# EAGLE design APU (EAGLE 9.6.2)

## Sheet 1 of 3: APU_Capteur
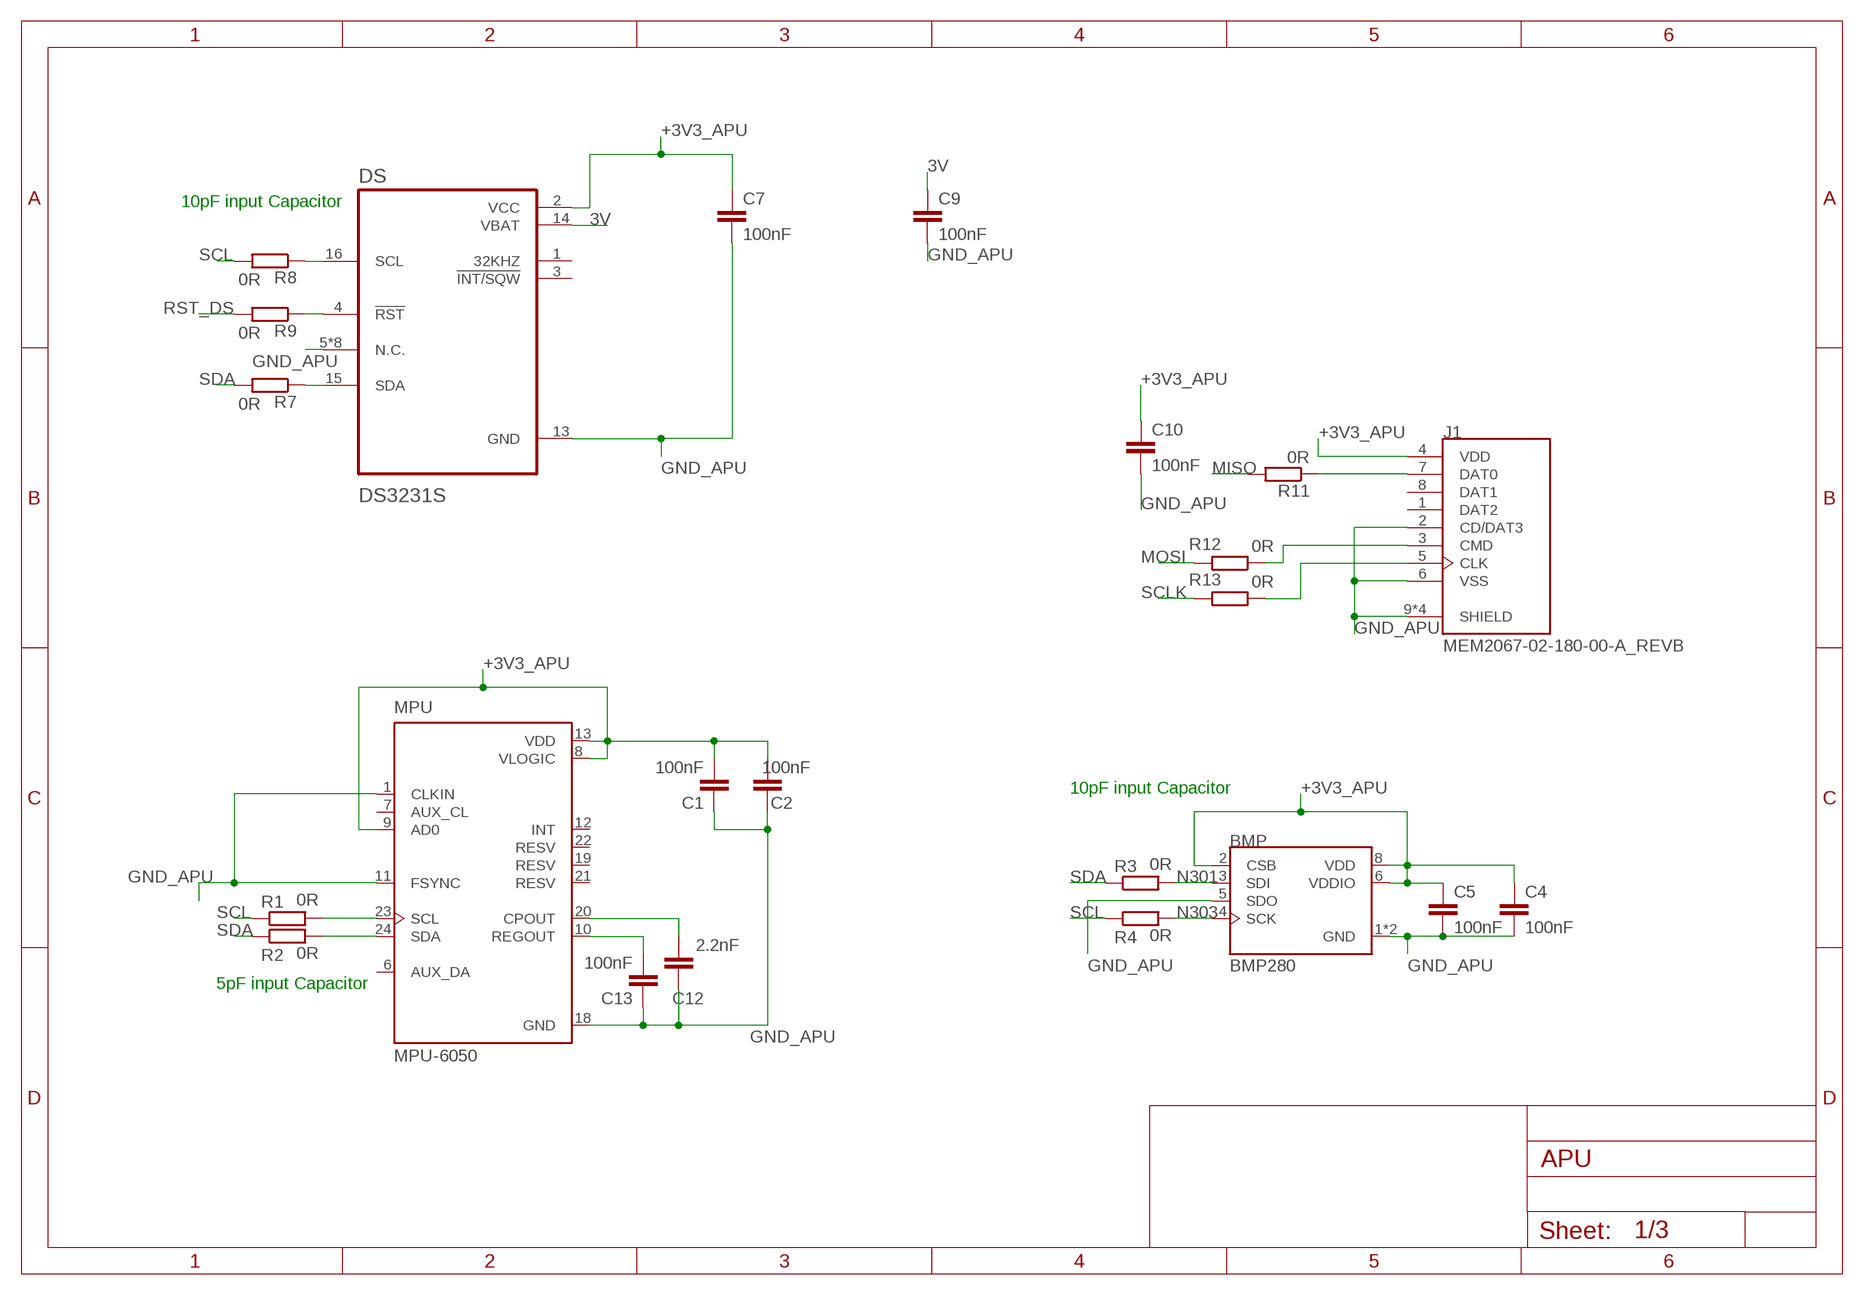
[diagram p0: schematic, sheet 1]

### Parts
BMP  BMP280  [XDCR_BMP280]
C1  100nF  C-EUC0805  [C0805]
C2  100nF  C-EUC0805  [C0805]
C4  100nF  C-EUC0805  [C0805]
C5  100nF  C-EUC0805  [C0805]
C7  100nF  C-EUC0805  [C0805]
C9  100nF  C-EUC0805  [C0805]
C10  100nF  C-EUC0805  [C0805]
C12  2.2nF  C-EUC0805  [C0805]
C13  100nF  C-EUC0805  [C0805]
DS  DS3231S  [SOIC127P1032X265-16N]
J1  MEM2067-02-180-00-A_REVB  [GCT_MEM2067-02-180-00-A_REVB]
MPU  MPU-6050  [QFN50P400X400X95-24N]
R1  0R  R-EU_R0603  [R0603]
R2  0R  R-EU_R0603  [R0603]
R3  0R  R-EU_R0603  [R0603]
R4  0R  R-EU_R0603  [R0603]
R7  0R  R-EU_R0603  [R0603]
R8  0R  R-EU_R0603  [R0603]
R9  0R  R-EU_R0603  [R0603]
R11  0R  R-EU_R0603  [R0603]
R12  0R  R-EU_R0603  [R0603]
R13  0R  R-EU_R0603  [R0603]

### Nets
3V [Power]: C9.1 DS.14(VBAT) ; also sheet 2
+3V3_APU [Power]: BMP.2(CSB) BMP.6(VDDIO) BMP.8(VDD) C1.2 C2.2 C4.1 C5.1 C7.1 C10.1 DS.2(VCC) J1.4(VDD) MPU.8(VLOGIC) MPU.9(AD0) MPU.13(VDD) ; also sheet 2,3
GND_APU: BMP.1(GND) BMP.5(SDO) BMP.7(GND) C1.1 C2.1 C4.2 C5.2 C7.2 C9.2 C10.2 C12.1 C13.1 DS.5(N.C.) DS.6(N.C.) DS.7(N.C.) DS.8(N.C.) DS.9(N.C.) DS.10(N.C.) DS.11(N.C.) DS.12(N.C.) DS.13(GND) J1.2(CD/DAT3) J1.6(VSS) J1.9(SHIELD) J1.10(SHIELD) J1.11(SHIELD) J1.12(SHIELD) MPU.1(CLKIN) MPU.11(FSYNC) MPU.18(GND) ; also sheet 2,3
MISO [50Ohms]: R11.2 ; also sheet 3
MOSI [50Ohms]: R12.2 ; also sheet 3
N301 [50Ohms]: BMP.3(SDI) R3.2
N303 [50Ohms]: BMP.4(SCK) R4.2
N$1 [50Ohms]: MPU.24(SDA) R2.2
N$2 [50Ohms]: MPU.23(SCL) R1.2
N$3: C13.2 MPU.10(REGOUT)
N$4 [50Ohms]: DS.15(SDA) R7.1
N$5 [50Ohms]: DS.16(SCL) R8.1
N$6: DS.4(!RST) R9.1
N$7: J1.7(DAT0) R11.1
N$9 [50Ohms]: J1.5(CLK) R13.1
N$10 [50Ohms]: J1.3(CMD) R12.1
N$11: C12.2 MPU.20(CPOUT)
RST_DS: R9.2 ; also sheet 3
SCL [50Ohms]: R1.1 R4.1 R8.2 ; also sheet 2,3
SCLK [50Ohms]: R13.2 ; also sheet 3
SDA [50Ohms]: R2.1 R3.1 R7.2 ; also sheet 2,3
Unconnected: DS.1(32KHZ) DS.3(!INT/SQW) J1.1(DAT2) J1.8(DAT1) MPU.6(AUX_DA) MPU.7(AUX_CL) MPU.12(INT) MPU.19(RESV) MPU.21(RESV) MPU.22(RESV)

### Notes on the sheet
- 10pF input Capacitor
- 10pF input Capacitor
- 5pF input Capacitor

## Sheet 2 of 3: APU_Connecteur
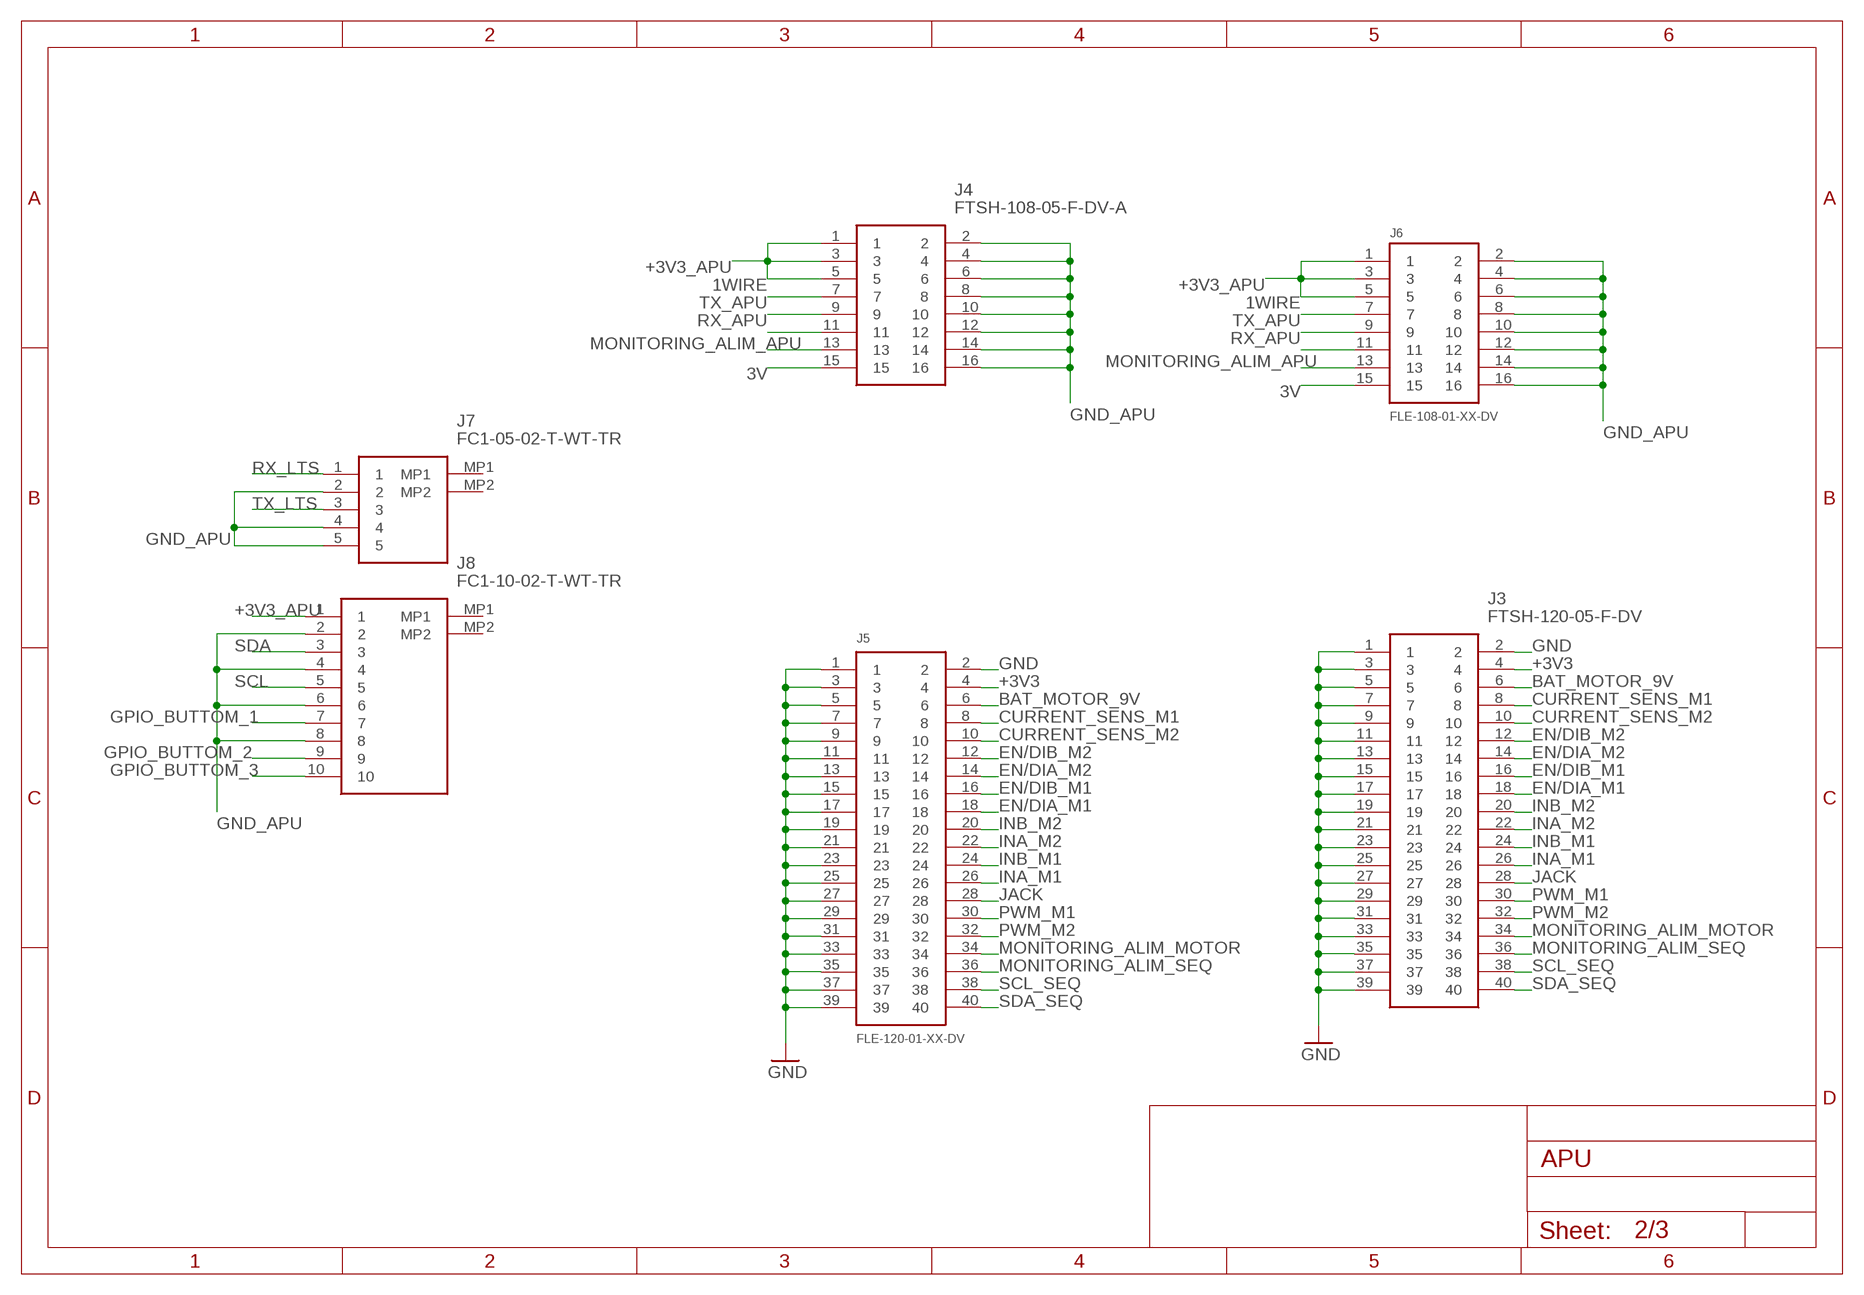
[diagram p1: schematic, sheet 2]

### Parts
J3  FTSH-120-05-F-DV  [FTSH-120-XX-YYY-DV]
J4  FTSH-108-05-F-DV-A  [FTSH-108-XX-YYY-DV-A]
J5  FLE-120-01-XX-DV  [FLE-120-01-XX-DV]
J6  FLE-108-01-XX-DV  [FLE-108-01-XX-DV]
J7  FC1-05-02-T-WT-TR  [FC10502TWTTR]
J8  FC1-10-02-T-WT-TR  [FC11002TWTTR]

### Nets
1WIRE [50Ohms]: J4.7 J6.7 ; also sheet 3
3V [Power]: J4.15 J6.15 ; also sheet 1
+3V3 [Power]: J3.4 J5.4
+3V3_APU [Power]: J4.1 J4.3 J4.5 J6.1 J6.3 J6.5 J8.1 ; also sheet 1,3
BAT_MOTOR_9V [Power]: J3.6 J5.6
CURRENT_SENS_M1: J3.8 J5.8
CURRENT_SENS_M2: J3.10 J5.10
EN/DIA_M1: J3.18 J5.18
EN/DIA_M2: J3.14 J5.14
EN/DIB_M1: J3.16 J5.16
EN/DIB_M2: J3.12 J5.12
GND: J3.1 J3.2 J3.3 J3.5 J3.7 J3.9 J3.11 J3.13 J3.15 J3.17 J3.19 J3.21 J3.23 J3.25 J3.27 J3.29 J3.31 J3.33 J3.35 J3.37 J3.39 J5.1 J5.2 J5.3 J5.5 J5.7 J5.9 J5.11 J5.13 J5.15 J5.17 J5.19 J5.21 J5.23 J5.25 J5.27 J5.29 J5.31 J5.33 J5.35 J5.37 J5.39
GND_APU: J4.2 J4.4 J4.6 J4.8 J4.10 J4.12 J4.14 J4.16 J6.2 J6.4 J6.6 J6.8 J6.10 J6.12 J6.14 J6.16 J7.2 J7.4 J7.5 J8.2 J8.4 J8.6 J8.8 ; also sheet 1,3
GPIO_BUTTOM_1: J8.7 ; also sheet 3
GPIO_BUTTOM_2: J8.9 ; also sheet 3
GPIO_BUTTOM_3: J8.10 ; also sheet 3
INA_M1: J3.26 J5.26
INA_M2: J3.22 J5.22
INB_M1: J3.24 J5.24
INB_M2: J3.20 J5.20
JACK: J3.28 J5.28
MONITORING_ALIM_APU: J4.13 J6.13 ; also sheet 3
MONITORING_ALIM_MOTOR: J3.34 J5.34
MONITORING_ALIM_SEQ: J3.36 J5.36
PWM_M1: J3.30 J5.30
PWM_M2: J3.32 J5.32
RX_APU [50Ohms]: J4.11 J6.11 ; also sheet 3
RX_LTS [50Ohms]: J7.1 ; also sheet 3
SCL [50Ohms]: J8.5 ; also sheet 1,3
SCL_SEQ [50Ohms]: J3.38 J5.38
SDA [50Ohms]: J8.3 ; also sheet 1,3
SDA_SEQ [50Ohms]: J3.40 J5.40
TX_APU [50Ohms]: J4.9 J6.9 ; also sheet 3
TX_LTS [50Ohms]: J7.3 ; also sheet 3
Unconnected: J7.MP1 J7.MP2 J8.MP1 J8.MP2

## Sheet 3 of 3: APU_microcontroleur
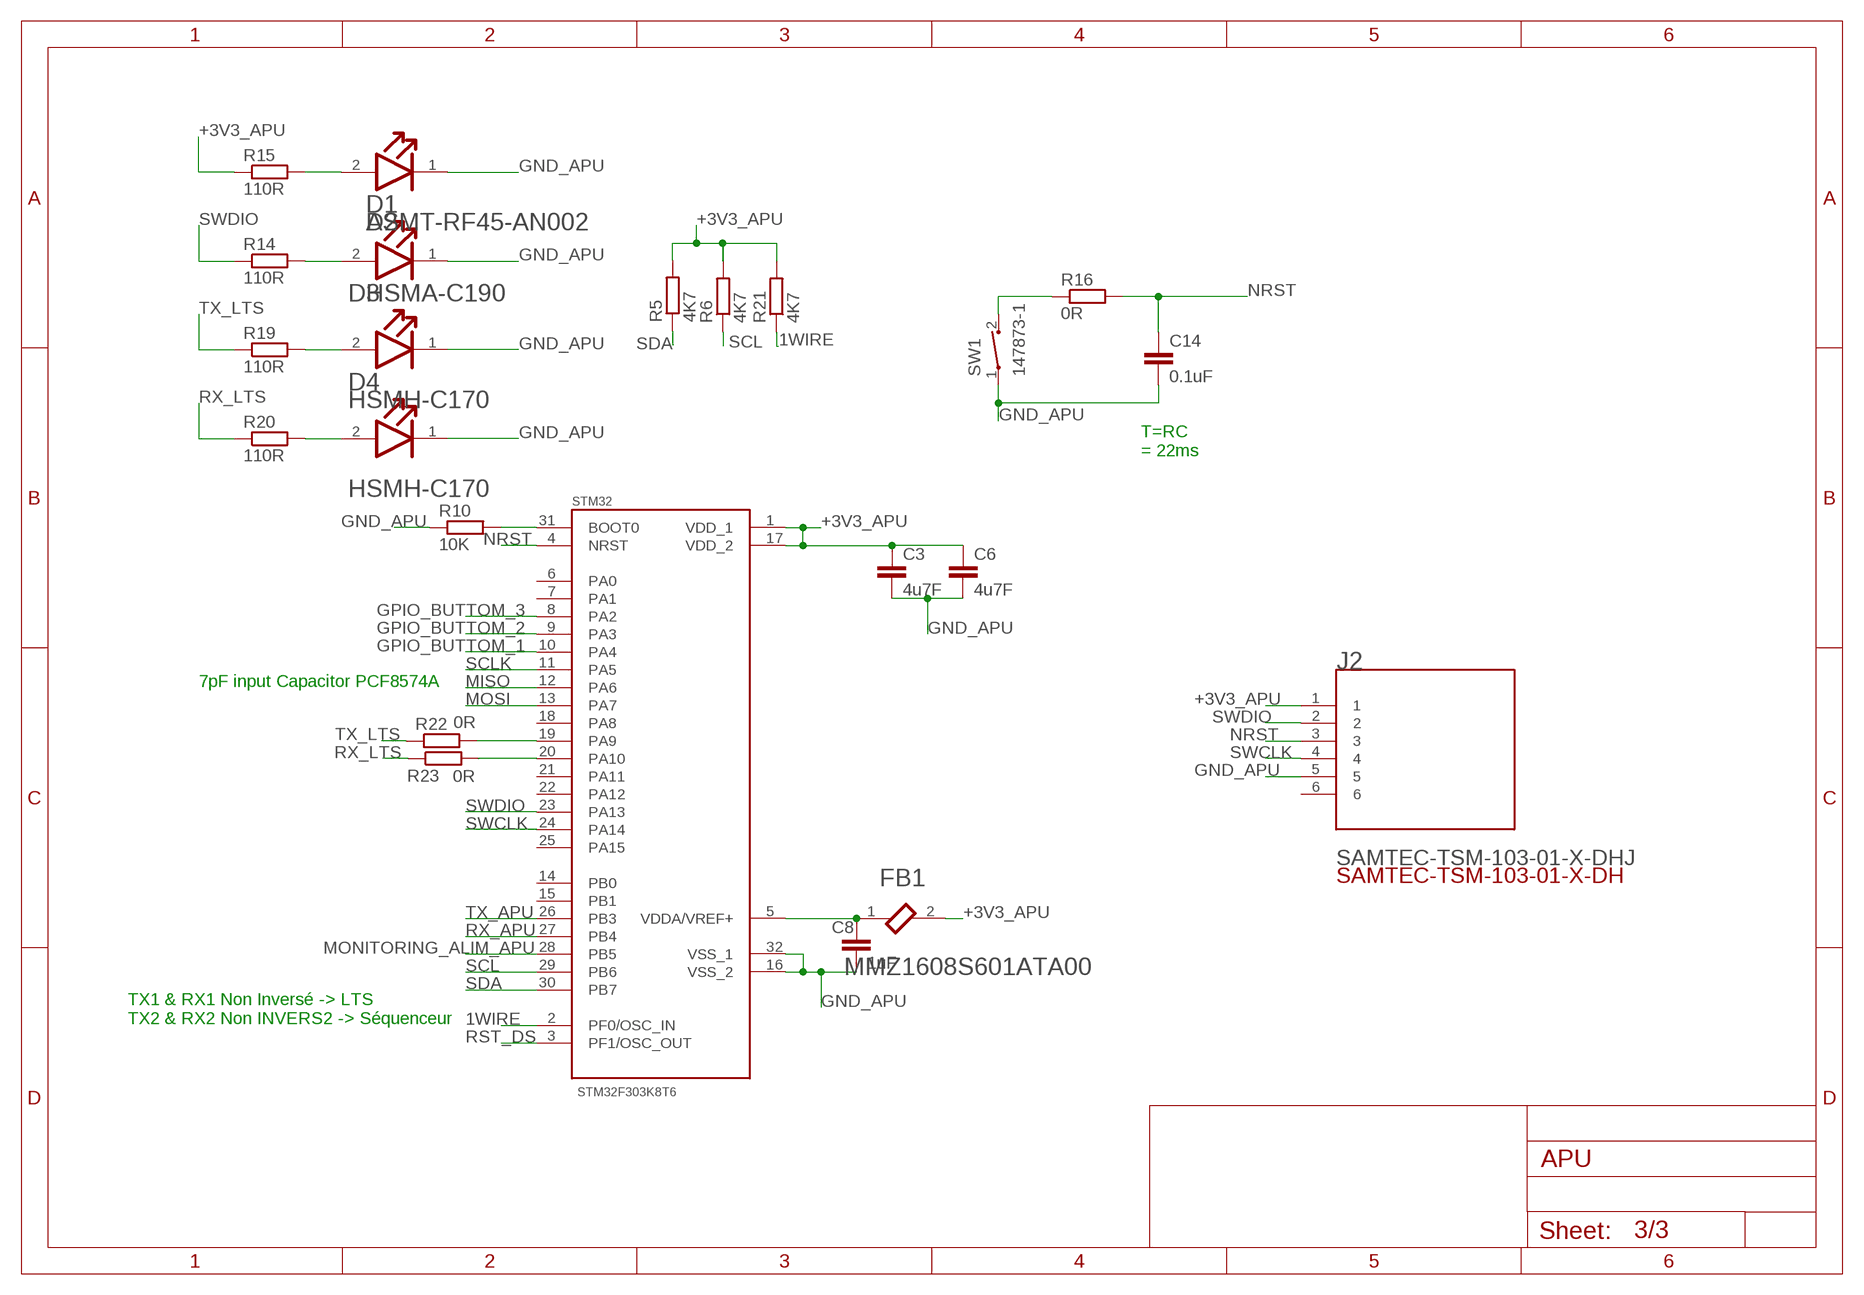
[diagram p2: schematic, sheet 3]

### Parts
C3  4u7F  C-EUC0805K  [C0805K]
C6  4u7F  C-EUC0805K  [C0805K]
C8  1uF  C-EUC0805K  [C0805K]
C14  0.1uF  C-EUC0805K  [C0805K]
D1  BROADCOM_ASMT-RF45-AN002BROADCOM_ASMT-RF45-AN002_0_0  [BROADCOM_ASMT-RF45-AN002_0]
D2  BROADCOM_HSMA-C190BROADCOM_HSMA-C190_0_0  [BROADCOM_HSMA-C190_0]
D3  BROADCOM_HSMH-C170BROADCOM_HSMH-C170_0_0  [BROADCOM_HSMH-C170_0]
D4  BROADCOM_HSMH-C170BROADCOM_HSMH-C170_0_0  [BROADCOM_HSMH-C170_0]
FB1  TDK_MMZ1608S601ATA00TDK_MMZ1608S601ATA00_0_0  [TDK_MMZ1608S601ATA00_0]
J2  SAMTEC-TSM-103-01-X-DHJ  [SAMTEC-TSM-103-01-X-DH]
R5  4K7  R-EU_R0603  [R0603]
R6  4K7  R-EU_R0603  [R0603]
R10  10K  R-EU_R0603  [R0603]
R14  110R  R-EU_R0603  [R0603]
R15  110R  R-EU_R0603  [R0603]
R16  0R  R-EU_R0603  [R0603]
R19  110R  R-EU_R0603  [R0603]
R20  110R  R-EU_R0603  [R0603]
R21  4K7  R-EU_R0603  [R0603]
R22  0R  R-EU_R0603  [R0603]
R23  0R  R-EU_R0603  [R0603]
STM32  STM32F303K8T6  [QFP80P900X900X160-32N]
SW1  147873-1  [SW_147873-1]

### Nets
1WIRE [50Ohms]: R21.1 STM32.2(PF0/OSC_IN) ; also sheet 2
+3V3_APU [Power]: C3.1 C6.1 FB1.2 J2.1 R5.2 R6.2 R15.1 R21.2 STM32.1(VDD_1) STM32.17(VDD_2) ; also sheet 1,2
GND_APU: C3.2 C6.2 C8.2 C14.2 D1.1(CATHODE) D2.1(CATHODE) D3.1(CATHODE) D4.1(CATHODE) J2.5 R10.1 STM32.16(VSS_2) STM32.32(VSS_1) SW1.1 ; also sheet 1,2
GPIO_BUTTOM_1: STM32.10(PA4) ; also sheet 2
GPIO_BUTTOM_2: STM32.9(PA3) ; also sheet 2
GPIO_BUTTOM_3: STM32.8(PA2) ; also sheet 2
MISO [50Ohms]: STM32.12(PA6) ; also sheet 1
MONITORING_ALIM_APU: STM32.28(PB5) ; also sheet 2
MOSI [50Ohms]: STM32.13(PA7) ; also sheet 1
N$8: C8.1 FB1.1 STM32.5(VDDA/VREF+)
N$12: R10.2 STM32.31(BOOT0)
N$13: D1.2(ANODE) R15.2
N$14: D3.2(ANODE) R19.2
N$15: D4.2(ANODE) R20.2
N$16: R22.2 STM32.19(PA9)
N$17: R23.2 STM32.20(PA10)
N$40: D2.2(ANODE) R14.2
N$61: R16.1 SW1.2
NRST: C14.1 J2.3 R16.2 STM32.4(NRST)
RST_DS: STM32.3(PF1/OSC_OUT) ; also sheet 1
RX_APU [50Ohms]: STM32.27(PB4) ; also sheet 2
RX_LTS [50Ohms]: R20.1 R23.1 ; also sheet 2
SCL [50Ohms]: R6.1 STM32.29(PB6) ; also sheet 1,2
SCLK [50Ohms]: STM32.11(PA5) ; also sheet 1
SDA [50Ohms]: R5.1 STM32.30(PB7) ; also sheet 1,2
SWCLK [50Ohms]: J2.4 STM32.24(PA14)
SWDIO [50Ohms]: J2.2 R14.1 STM32.23(PA13)
TX_APU [50Ohms]: STM32.26(PB3) ; also sheet 2
TX_LTS [50Ohms]: R19.1 R22.1 ; also sheet 2
Unconnected: J2.6 STM32.6(PA0) STM32.7(PA1) STM32.14(PB0) STM32.15(PB1) STM32.18(PA8) STM32.21(PA11) STM32.22(PA12) STM32.25(PA15)

### Notes on the sheet
- T=RC
  = 22ms
- 7pF input Capacitor PCF8574A
- TX1 & RX1 Non Inversé -> LTS
  TX2 & RX2 Non INVERS2 -> Séquenceur

## Library data of the parts
BMP = BMP280:BMP280: BMP280 Absolute Barometric Pressure Sensor for Battery Powered Devices 2 x 2.5mm Check prices <https://pricing.snapeda.com/parts/BMP280/Bosch/view-part?ref=eda>; AVAILABILITY: Warning; DESCRIPTION: Pressure Sensor 4.35PSI ~ 15.95PSI (30kPa ~ 110kPa) Absolute 16b 8-SMD; MF: Bosch; MP: BMP280; PACKAGE: SMD-8 Bosch Sensortec; PRICE: None; PURCHASE-URL: https://pricing.snapeda.com/search/part/BMP280/?ref=eda
C1-C10 C12-C14 = rcl:C-EU: CAPACITOR, European symbol; SPICEPREFIX: C
D1 = Broadcom - ASMT-RF45-AN002:BROADCOM_ASMT-RF45-AN002: LED YLW/GREEN DIFFUSED 0603 SMD; AUTOMOTIVE: No; CENTROID_NOT_SPECIFIED: No; COLOUR: Yellow Green; DATASHEET: https://docs.broadcom.com/docs/AV02-0378EN; DEVICE_CLASS_L1: Optoelectronics; DEVICE_CLASS_L2: LEDs; DEVICE_CLASS_L3: unset; DIGIKEY_DESCRIPTION: DIODE LED YLW/GREEN DIFFUSED 0603 SMD; DIGIKEY_PART_NUMBER: 516-2522-1-ND; FOOTPRINT_VARIANT_NAME_0: Recommended_Land_Pattern; FORWARD_CURRENT: 20mA; FORWARD_VOLTAGE: 2V; HEIGHT: 0.55mm; LEAD_FREE: Yes; LED_ORIENTATION: Top View; LUMINOUS_INTENSITY: 60mcd; MAX_JUNCTION_TEMP: +110°C; MF: Broadcom; MFG_PACKAGE_IDENT: ASMT-RF45-AN002; MFG_PACKAGE_IDENT_DATE: 0; MFG_PACKAGE_IDENT_REV: 0; MOUSER_DESCRIPTION: LED; SMD; 0603; yellow green; 28-60mcd; 1.6x0.8x0.45mm; 145°; 20mA; MOUSER_PART_NUMBER: 630-ASMT-RF45-AN002; MPN: ASMT-RF45-AN002; PACKAGE: SMD2; PEAK_EMMISION_WAVELENGTH: 574nm; POWER_DISSIPATION: 48mW; PREFIX: D; REVERSE_VOLTAGE: 5V; ROHS: Yes; TEMPERATURE_RANGE_HIGH: +100°C; TEMPERATURE_RANGE_LOW: -40°C; VERIFICATION_VERSION: 0.0.0.3; VIEWING_ANGLE: 145°; WAVELENGTH: 573nm
D2 = Broadcom - HSMA-C190:BROADCOM_HSMA-C190: Amber 592nm LED Indication - Discrete 1.9V 0603 (1608 Metric); AUTOMOTIVE: No; CENTROID_NOT_SPECIFIED: No; COLOUR: Amber; DATASHEET: https://docs.broadcom.com/doc/AV02-0112EN; DEVICE_CLASS_L1: Optoelectronics; DEVICE_CLASS_L2: LEDs; DEVICE_CLASS_L3: unset; DIGIKEY_DESCRIPTION: LED AMBER DIFFUSED CHIP SMD; DIGIKEY_PART_NUMBER: 516-1423-1-ND; FOOTPRINT_VARIANT_NAME_0: Recommended_Land_Pattern; FORWARD_CURRENT: 20mA; FORWARD_VOLTAGE: 1.9V; HEIGHT: 0.9mm; LEAD_FREE: Yes; LED_ORIENTATION: Top View; LUMINOUS_INTENSITY: 90mcd; MAX_JUNCTION_TEMP: +95°C; MF: Broadcom; MFG_PACKAGE_IDENT: 0; MFG_PACKAGE_IDENT_DATE: 0; MFG_PACKAGE_IDENT_REV: 0; MOUSER_DESCRIPTION: LED Uni-Color Amber 595nm 2-Pin Chip LED T/R; MOUSER_PART_NUMBER: 630-HSMA-C190; MPN: HSMA-C190; PACKAGE: 0603; PEAK_EMMISION_WAVELENGTH: 595nm; POWER_DISSIPATION: 60mW; PREFIX: D; REVERSE_VOLTAGE: 5V; ROHS: Yes; TEMPERATURE_RANGE_HIGH: +85°C; TEMPERATURE_RANGE_LOW: -40°C; VERIFICATION_VERSION: 0.0.0.3; VIEWING_ANGLE: 170°; VOLTAGE: 1.9V; WAVELENGTH: 592nm
D3 D4 = Broadcom - HSMH-C170:BROADCOM_HSMH-C170: LED RED DIFFUSED 0805 SMD; CENTROID_NOT_SPECIFIED: No; COLOUR: Red; DATASHEET: https://media.digikey.com/pdf/Data%20Sheets/Avago%20PDFs/HSMz-Czzz.pdf; DEVICE_CLASS_L1: Optoelectronics; DEVICE_CLASS_L2: LEDs; DEVICE_CLASS_L3: unset; DIGIKEY_DESCRIPTION: DIODE LED RED DIFFUSED 0805 SMD; DIGIKEY_PART_NUMBER: 516-1427-1-ND; FORWARD_CURRENT: 25mA; FORWARD_VOLTAGE: 1.8V; HEIGHT: 0.9mm; LEAD_FREE: yes; LED_ORIENTATION: Top View; LUMINOUS_INTENSITY: 17mcd; MAX_JUNCTION_TEMP: +95°C; MF: Broadcom; MFG_PACKAGE_IDENT: HSMH-C170; MFG_PACKAGE_IDENT_DATE: 0; MFG_PACKAGE_IDENT_REV: 0; MOUSER_PART_NUMBER: 630-HSMH-C170; MPN: HSMH-C170; PACKAGE: 0805 (2012 metric); POWER_DISSIPATION: 65mW; PREFIX: D; REVERSE_VOLTAGE: 5V; ROHS: yes; STANDOFF_HEIGHT: 0mm; TEMPERATURE_RANGE_HIGH: +85°C; TEMPERATURE_RANGE_LOW: -40°C; VERIFICATION_VERSION: 0.0.0.1; VIEWING_ANGLE: 170°; WAVELENGTH: 639nm
DS = DS3231S:DS3231S: Check prices <https://pricing.snapeda.com/parts/DS3231S/Maxim%20Integrated/view-part?ref=eda>; AVAILABILITY: Warning; DESCRIPTION: Real Time Clock (RTC) IC Clock/Calendar I²C, 2-Wire Serial 16-SOIC (0.295, 7.50mm Width); MF: Maxim Integrated; MP: DS3231S; PACKAGE: SOIC-16 Maxim Integrated; PRICE: None; PURCHASE-URL: https://pricing.snapeda.com/search/part/DS3231S/?ref=eda
FB1 = TDK - MMZ1608S601ATA00:TDK_MMZ1608S601ATA00: Signal Line Ferrite Bead 600Ω @ 100MHz 500mA DCR 350mΩ SMD 0603; AUTOMOTIVE: No; CENTROID_NOT_SPECIFIED: No; CORE_MATERIAL: Ferrite; DATASHEET: https://product.tdk.com/en/search/emc/emc/beads/info?part_no=MMZ1608S601ATA00; DEVICE_CLASS_L1: Passive Components; DEVICE_CLASS_L2: EMI / RFI Components; DEVICE_CLASS_L3: Ferrite Beads and Chips; FOOTPRINT_PARAMETERS_1: {"fp_type":"chip_res","params":{"L":{"nom":1600000,"long name":"Length","min":1450000,"max":1750000,"short name":"L","type":"measurement"},"W":{"nom":800000,"long name":"Width","min":650000,"max":950000,"short name":"W","type":"measurement"},"t":{"nom":800000,"long name":"Height","min":650000,"max":950000,"short name":"t","type":"measurement"},"b":{"nom":300000,"long name":"Terminal width","min":100000,"max":500000,"short name":"b","type":"measurement"},"P":{"default":"false","long name":"Polarized","type":"multichoice","short name":"P"},"offset x":{"nom":0,"long name":"X Center offset","min":null,"max":null,"short name":"offset x","type":"measurement"},"offset y":{"nom":0,"long name":"Y Center offset","min":null,"max":null,"short name":"offset y","type":"measurement"},"LS":{"long name":"Land shape","type":"fixed","short name":"LS","value":"Rectangle"},"solder toe":{"nom":550000,"long name":"Solder fillet (toe)","min":null,"max":null,"short name":"solder toe","type":"fixedmeasurement"},"solder heel":{"nom":0,"long name":"Solder fillet (heel)","min":null,"max":null,"short name":"solder heel","type":"fixedmeasurement"},"solder side":{"nom":50000,"long name":"Solder fillet (side)","min":null,"max":null,"short name":"solder side","type":"fixedmeasurement"},"courtyard":{"nom":500000,"long name":"Courtyard","min":null,"max":null,"short name":"courtyard","type":"fixedmeasurement"},"SF":{"default":"A (>= 1608 metric)","long name":"Packing level","type":"multichoiceparent","short name":"SF","help":"http://support.upverter.com/customer/portal/articles/978783-what-is-a-footprint-packing-level","children":["solder toe","solder heel","solder side","courtyard"]}}}; FOOTPRINT_PARAMETERS_2: {"fp_type":"chip_res","params":{"L":{"nom":1600000,"long name":"Length","min":1450000,"max":1750000,"short name":"L","type":"measurement"},"W":{"nom":800000,"long name":"Width","min":650000,"max":950000,"short name":"W","type":"measurement"},"t":{"nom":800000,"long name":"Height","min":650000,"max":950000,"short name":"t","type":"measurement"},"b":{"nom":300000,"long name":"Terminal width","min":100000,"max":500000,"short name":"b","type":"measurement"},"P":{"default":"false","long name":"Polarized","type":"multichoice","short name":"P"},"offset x":{"nom":0,"long name":"X Center offset","min":null,"max":null,"short name":"offset x","type":"measurement"},"offset y":{"nom":0,"long name":"Y Center offset","min":null,"max":null,"short name":"offset y","type":"measurement"},"LS":{"long name":"Land shape","type":"fixed","short name":"LS","value":"Rectangle"},"solder toe":{"nom":350000,"long name":"Solder fillet (toe)","min":null,"max":null,"short name":"solder toe","type":"fixedmeasurement"},"solder heel":{"nom":0,"long name":"Solder fillet (heel)","min":null,"max":null,"short name":"solder heel","type":"fixedmeasurement"},"solder side":{"nom":0,"long name":"Solder fillet (side)","min":null,"max":null,"short name":"solder side","type":"fixedmeasurement"},"courtyard":{"nom":250000,"long name":"Courtyard","min":null,"max":null,"short name":"courtyard","type":"fixedmeasurement"},"SF":{"default":"B (>= 1608 metric)","long name":"Packing level","type":"multichoiceparent","short name":"SF","help":"http://support.upverter.com/customer/portal/articles/978783-what-is-a-footprint-packing-level","children":["solder toe","solder heel","solder side","courtyard"]}}}; FOOTPRINT_PARAMETERS_3: {"fp_type":"chip_res","params":{"L":{"nom":1600000,"long name":"Length","min":1450000,"max":1750000,"short name":"L","type":"measurement"},"W":{"nom":800000,"long name":"Width","min":650000,"max":950000,"short name":"W","type":"measurement"},"t":{"nom":800000,"long name":"Height","min":650000,"max":950000,"short name":"t","type":"measurement"},"b":{"nom":300000,"long name":"Terminal width","min":100000,"max":500000,"short name":"b","type":"measurement"},"P":{"default":"false","long name":"Polarized","type":"multichoice","short name":"P"},"offset x":{"nom":0,"long name":"X Center offset","min":null,"max":null,"short name":"offset x","type":"measurement"},"offset y":{"nom":0,"long name":"Y Center offset","min":null,"max":null,"short name":"offset y","type":"measurement"},"LS":{"long name":"Land shape","type":"fixed","short name":"LS","value":"Rectangle"},"solder toe":{"nom":150000,"long name":"Solder fillet (toe)","min":null,"max":null,"short name":"solder toe","type":"fixedmeasurement"},"solder heel":{"nom":0,"long name":"Solder fillet (heel)","min":null,"max":null,"short name":"solder heel","type":"fixedmeasurement"},"solder side":{"nom":-50000,"long name":"Solder fillet (side)","min":null,"max":null,"short name":"solder side","type":"fixedmeasurement"},"courtyard":{"nom":100000,"long name":"Courtyard","min":null,"max":null,"short name":"courtyard","type":"fixedmeasurement"},"SF":{"default":"C (>= 1608 metric)","long name":"Packing level","type":"multichoiceparent","short name":"SF","help":"http://support.upverter.com/customer/portal/articles/978783-what-is-a-footprint-packing-level","children":["solder toe","solder heel","solder side","courtyard"]}}}; FOOTPRINT_VARIANT_NAME_0: Recommended_Land_Pattern; FOOTPRINT_VARIANT_NAME_1: IPC_A; FOOTPRINT_VARIANT_NAME_2: IPC_B; FOOTPRINT_VARIANT_NAME_3: IPC_C; HEIGHT: 0.95mm; IMPEDANCE_AT_FREQUENCY: 600Ω @ 100MHz; IPC_LAND_PATTERN_NAME: CAPC16080X80; LEAD_FREE: Yes; MF: TDK; MFG_PACKAGE_IDENT: MMZ1608-0.8; MFG_PACKAGE_IDENT_COMPONENT_ID: 6a9689a634049a42; MFG_PACKAGE_IDENT_DATE: 0; MFG_PACKAGE_IDENT_REV: 0; MPN: MMZ1608S601ATA00; PACKAGE: 0603; PREFIX: FB; RMS_CURRENT: 500mA; ROHS: Yes; SERIES_RESISTANCE: 350mΩ; TEMPERATURE_RANGE_HIGH: +125°C; TEMPERATURE_RANGE_LOW: -55°C; TEST_FREQUENCY: 100MHz; TOLERANCE: 25%; VERIFICATION_VERSION: 0.0.0.3
J1 = MEM2067-02-180-00-A_REVB:MEM2067-02-180-00-A_REVB: Micro SD Memory Card ConnectorSMT, Hinged, 1.80mm Profile Check prices <https://pricing.snapeda.com/parts/MEM2067-02-180-00-A/Global%20Connector%20Technology/view-part?ref=eda>; AVAILABILITY: Warning; DESCRIPTION: 8 Position Card Connector microSD™ Surface Mount, Right Angle Gold; MF: Global Connector Technology; MP: MEM2067-02-180-00-A; PACKAGE: None; PRICE: None; PURCHASE-URL: https://pricing.snapeda.com/search/part/MEM2067-02-180-00-A/?ref=eda
J2 = SAMTEC-TSM-103-01-X-DH:SAMTEC-TSM-103-01-X-DH: Check prices <https://pricing.snapeda.com/parts/TSM-103-01-F-DH/Samtec%20Inc./view-part?ref=eda>; AVAILABILITY: Bad; DESCRIPTION: Connector Header Surface Mount, Right Angle 6 position 0.100 (2.54mm); MF: Samtec Inc.; MP: TSM-103-01-F-DH; PACKAGE: None; PRICE: None; PURCHASE-URL: https://pricing.snapeda.com/search/part/TSM-103-01-F-DH/?ref=eda
J3 = FTSH-120-05-F-DV:FTSH-120-05-F-DV: 40 Position, High Reliability Header Strips, 0.050" pitch Source: Datasheet <http://suddendocs.samtec.com/prints/ftsh-1xx-xx-xxx-dv-xxx-xxx-mkt.pdf>; DESCRIPTION: 40 Position, High Reliability Header Strips, 0.050&quot; pitch; HEIGHT: mm; MANUFACTURER_NAME: SAMTEC; MANUFACTURER_PART_NUMBER: FTSH-120-05-F-DV
J4 = FTSH-108-05-F-DV-A:FTSH-108-05-F-DV-A: 16 Position, High Reliability Header Strips, 0.050" pitch Source: Datasheet <http://suddendocs.samtec.com/prints/ftsh-1xx-xx-xxx-dv-xxx-xxx-mkt.pdf>; ARROW_PART_NUMBER: FTSH-108-05-F-DV-A; ARROW_PRICE-STOCK: https://www.arrow.com/en/products/ftsh-108-05-f-dv-a/samtec; DESCRIPTION: 16 Position, High Reliability Header Strips, 0.050&quot; pitch; HEIGHT: mm; MANUFACTURER_NAME: SAMTEC; MANUFACTURER_PART_NUMBER: FTSH-108-05-F-DV-A; MOUSER_PART_NUMBER: 200-FTSH10805FDVA; MOUSER_PRICE-STOCK: https://www.mouser.co.uk/ProductDetail/Samtec/FTSH-108-05-F-DV-A?qs=PB6%2FjmICvI1admAR1gVHNg%3D%3D
J5 = FLE-120-01-XX-DV:FLE-120-01-XX-DV: DOUBLE ROW 0.050"X0.050" STRIP ASSEMBLY. Check prices <https://pricing.snapeda.com/parts/FLE-120-01-G-DV/Samtec/view-part?ref=eda>; AVAILABILITY: Bad; DESCRIPTION: 40 Position Receptacle Connector Surface Mount; MF: Samtec; MP: FLE-120-01-G-DV; PACKAGE: None; PRICE: None; PURCHASE-URL: https://pricing.snapeda.com/search/part/FLE-120-01-G-DV/?ref=eda
J6 = FLE-108-01-XX-DV:FLE-108-01-XX-DV: DOUBLE ROW 0.050"X0.050" STRIP ASSEMBLY. Check prices <https://pricing.snapeda.com/parts/FLE-108-01-G-DV/Samtec/view-part?ref=eda>; AVAILABILITY: Bad; DESCRIPTION: 16 Position Receptacle Connector Surface Mount; MF: Samtec; MP: FLE-108-01-G-DV; PACKAGE: None; PRICE: None; PURCHASE-URL: https://pricing.snapeda.com/search/part/FLE-108-01-G-DV/?ref=eda
J7 = FC1-05-02-T-WT-TR:FC1-05-02-T-WT-TR: FFC & FPC Connectors 1.00 mm Flat Flexible Cable (FFC) Socket Strip Source: Datasheet <http://suddendocs.samtec.com/catalog_english/fc1.pdf>; DESCRIPTION: FFC & FPC Connectors 1.00 mm Flat Flexible Cable (FFC) Socket Strip; HEIGHT: 5.19mm; MANUFACTURER_NAME: SAMTEC; MANUFACTURER_PART_NUMBER: FC1-05-02-T-WT-TR; MOUSER_PART_NUMBER: 200-FC10502TWTTR; MOUSER_PRICE-STOCK: https://www.mouser.co.uk/ProductDetail/Samtec/FC1-05-02-T-WT-TR?qs=rU5fayqh%252BE0IHNLE7hd%252B7w%3D%3D
J8 = FC1-10-02-T-WT-TR:FC1-10-02-T-WT-TR: FFC & FPC Connectors 1.00 mm Flat Flexible Cable (FFC) Socket Strip Source: Datasheet <http://suddendocs.samtec.com/prints/fc1-xx-xx-xx-xx-mkt.pdf>; DESCRIPTION: FFC & FPC Connectors 1.00 mm Flat Flexible Cable (FFC) Socket Strip; HEIGHT: 5.19mm; MANUFACTURER_NAME: SAMTEC; MANUFACTURER_PART_NUMBER: FC1-10-02-T-WT-TR; MOUSER_PART_NUMBER: 200-FC11002TWTTR; MOUSER_PRICE-STOCK: https://www.mouser.com/Search/Refine.aspx?Keyword=200-FC11002TWTTR
MPU = MPU-6050:MPU-6050: MPU-6050 Six-Axis (Gyro + Accelerometer) MEMS MotionTracking™ Devices Check prices <https://pricing.snapeda.com/parts/MPU-6050/TDK%20InvenSense/view-part?ref=eda>; AVAILABILITY: Warning; DESCRIPTION: IMU ACCEL/GYRO 3-AXIS I2C 24QFN; MF: TDK InvenSense; MP: MPU-6050; PACKAGE: VFQFN-24 TDK InvenSense; PRICE: None; PURCHASE-URL: https://pricing.snapeda.com/search/part/MPU-6050/?ref=eda
R1-R16 R19-R23 = rcl:R-EU_: RESISTOR, European symbol; SPICEPREFIX: R
STM32 = STM32F303K8T6:STM32F303K8T6: Analog and DSP with FPU ARM Cortex-M4 MCU with 64 Kbytes Flash, 72 MHz CPU, CCM, 12-bit ADC 5 MSPS, comparators, op-amp; MANUFACTURER: ST microelectronics
SW1 = 147873-1:147873-1: Switch Tactile OFF (ON) SPST Rectangular Button J-Bend 0.05A 24VDC 1.77N SMD T/R Check prices <https://pricing.snapeda.com/parts/147873-1/TE%20Connectivity/view-part?ref=eda>; AVAILABILITY: Good; COMMENT: 147873-1; DESCRIPTION: Switch Tactile OFF (ON) SPST Rectangular Button J-Bend 0.05A 24VDC 1.77N SMD T/R; MF: TE Connectivity; MP: 147873-1; PACKAGE: None; PRICE: None; PURCHASE-URL: https://pricing.snapeda.com/search/part/147873-1/?ref=eda

## Net classes
0 default: width 0.2 mm, clearance 0.127 mm
1 Power: width 0.4 mm, clearance 0.2 mm
2 50Ohms: width 0.147 mm, clearance 0.127 mm

## Board
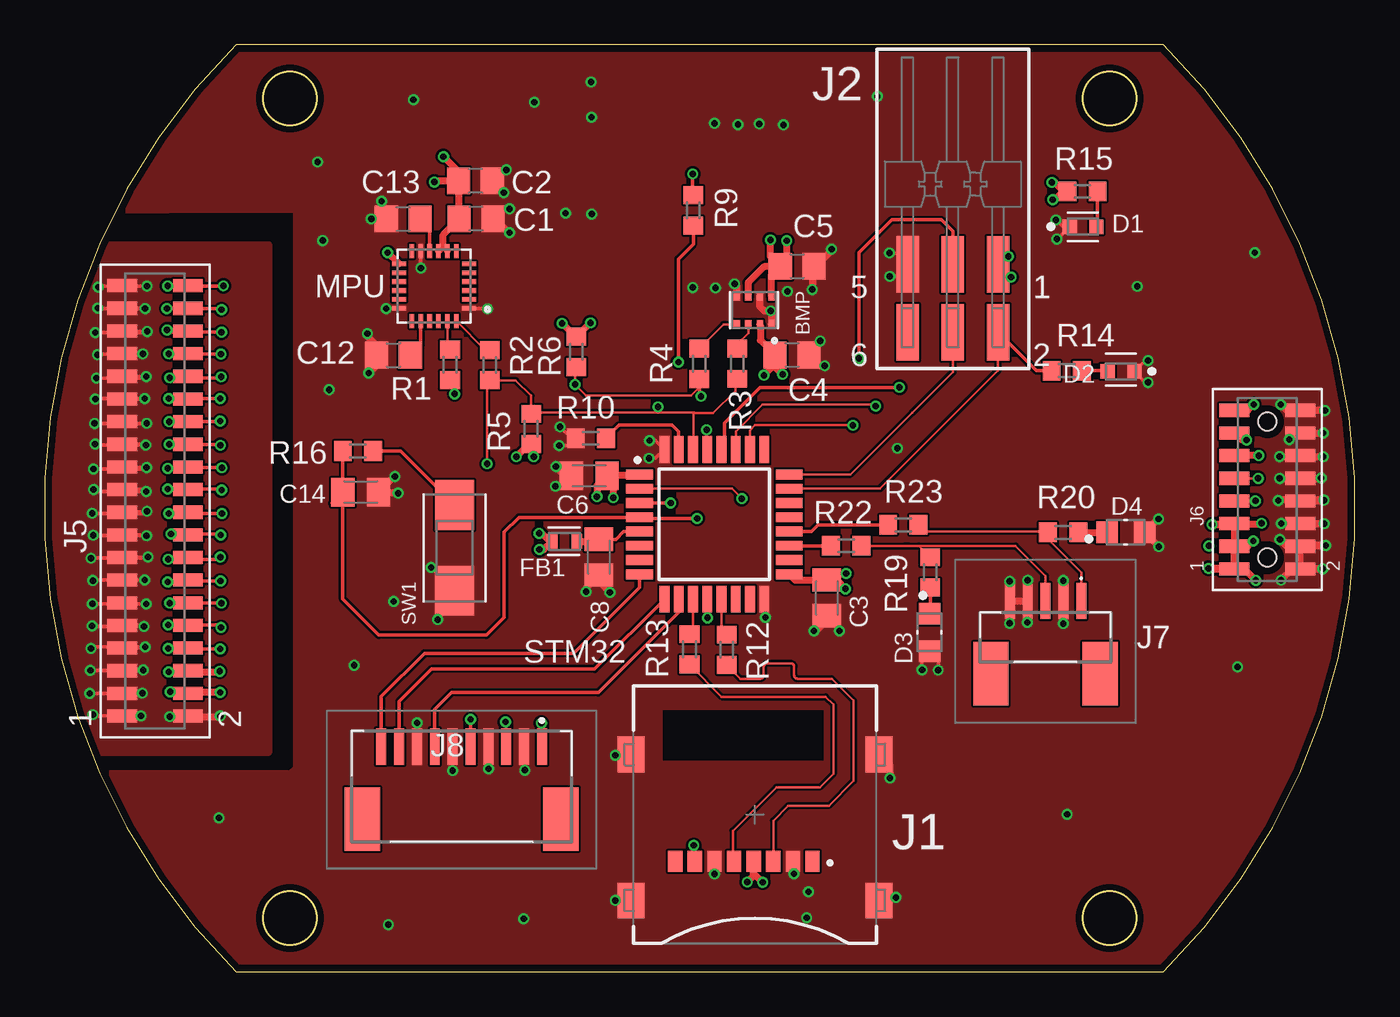
[diagram p3: board, top side]
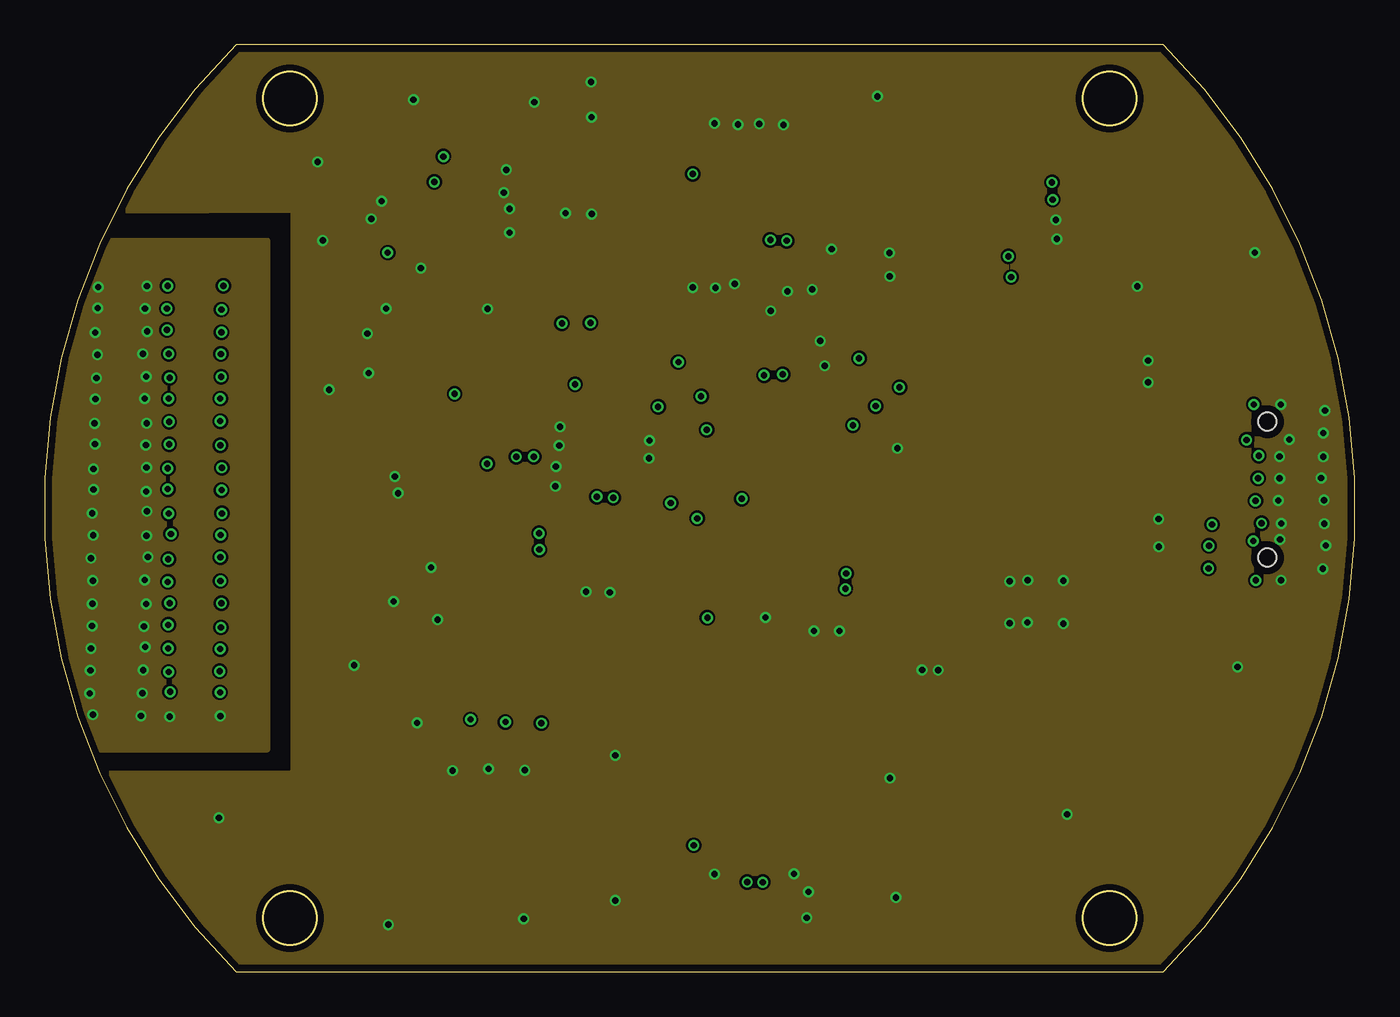
[diagram p4: board, inner layer Route2]
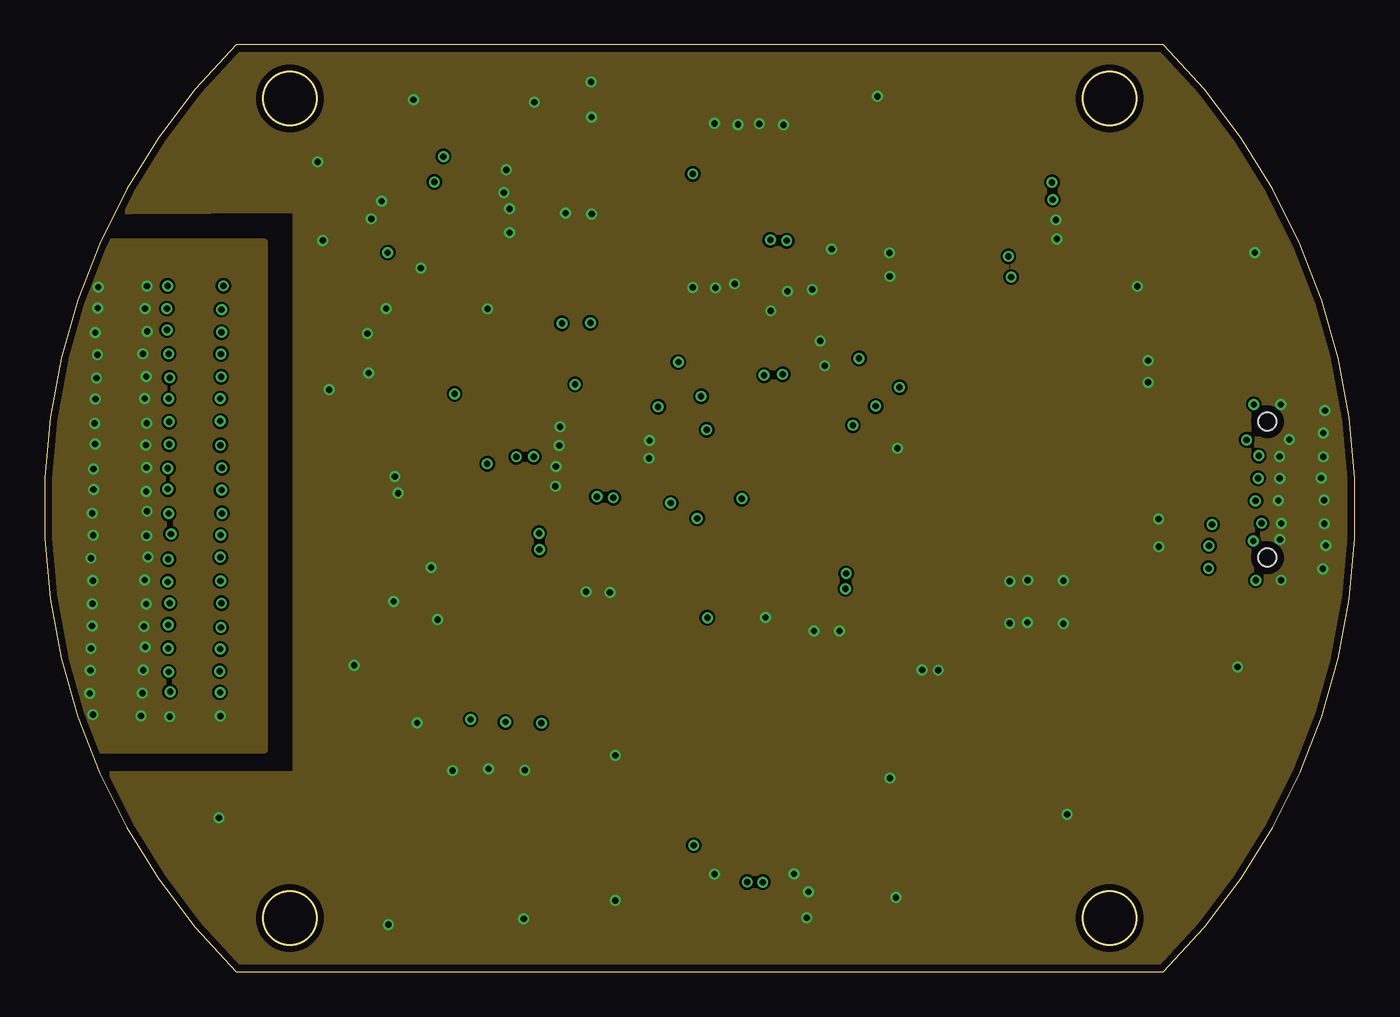
[diagram p5: board, inner layer Route15]
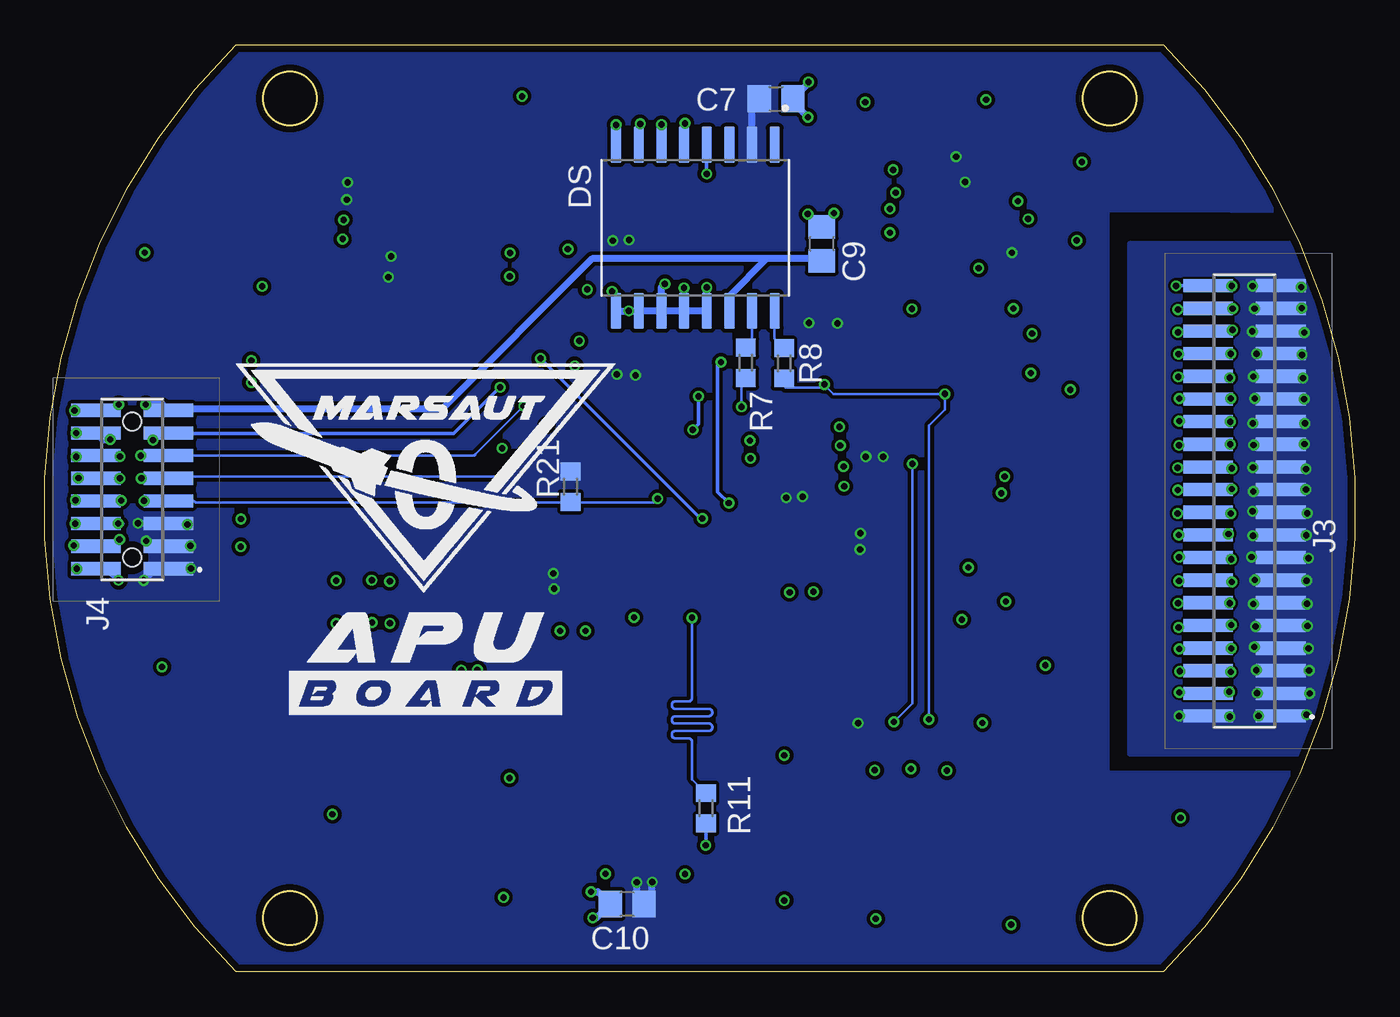
[diagram p6: board, bottom side, seen from below]

Size 73.46 x 52 mm. Coordinates in mm from the lower left corner, seen from the top.
Outline: 10.73,0 62.73,0 arc90 62.73,52 10.73,52 arc90 10.73,0
Outline: circle at 13.75,3.02 radius 1.5
Outline: circle at 59.71,48.98 radius 1.5
Outline: circle at 13.75,48.98 radius 1.5
Outline: circle at 59.71,3.02 radius 1.5
Copper layers (1+2*15+16): Top 0.035mm / dielectric 0.1mm / Route2 0.0175mm / dielectric 1.265mm / Route15 0.0175mm / dielectric 0.1mm / Bottom 0.035mm
Design rules "Marsaut0": minimum track width 3.5mil, minimum drill 0.2mm, track to track 4mil, track to pad 0.2mm, pad to pad 5mil, via to via 0.5mm, smd to smd 5mil, copper to edge 0.4mm, drill to drill 0.5mm, minimum pad ring 0.3mm, minimum via ring 0.13mm, stop-mask expansion 4mil, vias tented up to drill 0mil, thermal gap 10mil

### Footprints (pad centres in the part's own frame; a part is rotated, then mirrored left to right if it is on the bottom)
XDCR_BMP280 = smd 0.5 x 0.35: 1 0.8,0.975; 2 0.8,0.325; 3 0.8,-0.325; 4 0.8,-0.975; 5 -0.8,-0.975; 6 -0.8,-0.325; 7 -0.8,0.325; 8 -0.8,0.975
C0805 = smd 1.3 x 1.5: 1 -0.95,0; 2 0.95,0
C0805K = smd 1.3 x 1.6: 1 -1,0; 2 1,0
BROADCOM_ASMT-RF45-AN002_0 = smd 0.8 x 0.8: 1 -0.75,0; 2 0.75,0
BROADCOM_HSMA-C190_0 = smd 0.8 x 0.8: 1 -0.75,0; 2 0.75,0
BROADCOM_HSMH-C170_0 = smd 1.2 x 1.2: 1 -1.05,0; 2 1.05,0
SOIC127P1032X265-16N = smd 2.05 x 0.59: 1 -4.655,4.445; 2 -4.655,3.175; 3 -4.655,1.905; 4 -4.655,0.635; 5 -4.655,-0.635; 6 -4.655,-1.905; 7 -4.655,-3.175; 8 -4.655,-4.445; 9 4.655,-4.445; 10 4.655,-3.175; 11 4.655,-1.905; 12 4.655,-0.635; 13 4.655,0.635; 14 4.655,1.905; 15 4.655,3.175; 16 4.655,4.445
TDK_MMZ1608S601ATA00_0 = smd 0.6 x 0.8: 1 -0.7,0; 2 0.7,0
GCT_MEM2067-02-180-00-A_REVB = smd 0.8 x 1.2: 1 3.225,-2.625; 2 2.125,-2.625; 3 1.025,-2.625; 4 -0.075,-2.625; 5 -1.175,-2.625; 6 -2.275,-2.625; 7 -3.375,-2.625; 8 -4.475,-2.625 | smd 1.5 x 2: 9 -6.945,-4.825; 10 -6.945,3.375; 11 6.945,3.375; 12 6.945,-4.825
SAMTEC-TSM-103-01-X-DH = smd 1.27 x 3.18: 1 -2.54,4.496; 2 -2.54,8.306; 3 0,4.496; 4 0,8.306; 5 2.54,4.496; 6 2.54,8.306
FTSH-120-XX-YYY-DV = smd 0.74 x 2.79: 1 -12.065,-2.035; 2 -12.065,2.035; 3 -10.795,-2.035; 4 -10.795,2.035; 5 -9.525,-2.035; 6 -9.525,2.035; 7 -8.255,-2.035; 8 -8.255,2.035; 9 -6.985,-2.035; 10 -6.985,2.035; 11 -5.715,-2.035; 12 -5.715,2.035; 13 -4.445,-2.035; 14 -4.445,2.035; 15 -3.175,-2.035; 16 -3.175,2.035; 17 -1.905,-2.035; 18 -1.905,2.035; 19 -0.635,-2.035; 20 -0.635,2.035; 21 0.635,-2.035; 22 0.635,2.035; 23 1.905,-2.035; 24 1.905,2.035; 25 3.175,-2.035; 26 3.175,2.035; 27 4.445,-2.035; 28 4.445,2.035; 29 5.715,-2.035; 30 5.715,2.035; 31 6.985,-2.035; 32 6.985,2.035; 33 8.255,-2.035; 34 8.255,2.035; 35 9.525,-2.035; 36 9.525,2.035; 37 10.795,-2.035; 38 10.795,2.035; 39 12.065,-2.035; 40 12.065,2.035
FTSH-108-XX-YYY-DV-A = smd 0.74 x 2.79: 1 -4.445,-2.035; 2 -4.445,2.035; 3 -3.175,-2.035; 4 -3.175,2.035; 5 -1.905,-2.035; 6 -1.905,2.035; 7 -0.635,-2.035; 8 -0.635,2.035; 9 0.635,-2.035; 10 0.635,2.035; 11 1.905,-2.035; 12 1.905,2.035; 13 3.175,-2.035; 14 3.175,2.035; 15 4.445,-2.035; 16 4.445,2.035 | hole 1.02: -3.81,0; 3.81,0
FLE-120-01-XX-DV = smd 0.737 x 1.676: 1 -12.065,1.841; 2 -12.065,-1.841; 3 -10.795,1.841; 4 -10.795,-1.841; 5 -9.525,1.841; 6 -9.525,-1.841; 7 -8.255,1.841; 8 -8.255,-1.841; 9 -6.985,1.841; 10 -6.985,-1.841; 11 -5.715,1.841; 12 -5.715,-1.841; 13 -4.445,1.841; 14 -4.445,-1.841; 15 -3.175,1.841; 16 -3.175,-1.841; 17 -1.905,1.841; 18 -1.905,-1.841; 19 -0.635,1.841; 20 -0.635,-1.841; 21 0.635,1.841; 22 0.635,-1.841; 23 1.905,1.841; 24 1.905,-1.841; 25 3.175,1.841; 26 3.175,-1.841; 27 4.445,1.841; 28 4.445,-1.841; 29 5.715,1.841; 30 5.715,-1.841; 31 6.985,1.841; 32 6.985,-1.841; 33 8.255,1.841; 34 8.255,-1.841; 35 9.525,1.841; 36 9.525,-1.841; 37 10.795,1.841; 38 10.795,-1.841; 39 12.065,1.841; 40 12.065,-1.841
FLE-108-01-XX-DV = smd 0.737 x 1.676: 1 -4.445,1.841; 2 -4.445,-1.841; 3 -3.175,1.841; 4 -3.175,-1.841; 5 -1.905,1.841; 6 -1.905,-1.841; 7 -0.635,1.841; 8 -0.635,-1.841; 9 0.635,1.841; 10 0.635,-1.841; 11 1.905,1.841; 12 1.905,-1.841; 13 3.175,1.841; 14 3.175,-1.841; 15 4.445,1.841; 16 4.445,-1.841
FC10502TWTTR = smd 0.56 x 2.03: 1 -2,-2.033; 2 -1,-2.033; 3 0,-2.033; 4 1,-2.033; 5 2,-2.033 | smd 1.98 x 3.56: MP1 -3.06,2.033; MP2 3.06,2.033
FC11002TWTTR = smd 0.56 x 2.03: 1 -4.5,0.865; 2 -3.5,0.865; 3 -2.5,0.865; 4 -1.5,0.865; 5 -0.5,0.865; 6 0.5,0.865; 7 1.5,0.865; 8 2.5,0.865; 9 3.5,0.865; 10 4.5,0.865 | smd 1.98 x 3.56: MP1 -5.56,4.93; MP2 5.56,4.93
QFN50P400X400X95-24N = smd 0.79 x 0.26: 1 -1.97,1.25; 2 -1.97,0.75; 3 -1.97,0.25; 4 -1.97,-0.25; 5 -1.97,-0.75; 6 -1.97,-1.25; 13 1.97,-1.25; 14 1.97,-0.75; 15 1.97,-0.25; 16 1.97,0.25; 17 1.97,0.75; 18 1.97,1.25 | smd 0.26 x 0.79: 7 -1.25,-1.97; 8 -0.75,-1.97; 9 -0.25,-1.97; 10 0.25,-1.97; 11 0.75,-1.97; 12 1.25,-1.97; 19 1.25,1.97; 20 0.75,1.97; 21 0.25,1.97; 22 -0.25,1.97; 23 -0.75,1.97; 24 -1.25,1.97
R0603 = smd 1 x 1.1: 1 -0.85,0; 2 0.85,0
QFP80P900X900X160-32N = smd 1.5 x 0.55: 1 -4.2,2.8; 2 -4.2,2; 3 -4.2,1.2; 4 -4.2,0.4; 5 -4.2,-0.4; 6 -4.2,-1.2; 7 -4.2,-2; 8 -4.2,-2.8; 17 4.2,-2.8; 18 4.2,-2; 19 4.2,-1.2; 20 4.2,-0.4; 21 4.2,0.4; 22 4.2,1.2; 23 4.2,2; 24 4.2,2.8 | smd 0.55 x 1.5: 9 -2.8,-4.2; 10 -2,-4.2; 11 -1.2,-4.2; 12 -0.4,-4.2; 13 0.4,-4.2; 14 1.2,-4.2; 15 2,-4.2; 16 2.8,-4.2; 25 2.8,4.2; 26 2,4.2; 27 1.2,4.2; 28 0.4,4.2; 29 -0.4,4.2; 30 -1.2,4.2; 31 -2,4.2; 32 -2.8,4.2
SW_147873-1 = smd 2.8 x 2.2: 1 -2.4,0; 2 2.4,0

### Placement (x,y rotation side)
BMP  39.77,37.11 270 top
C1  24.19,42.23 180 top
C2  24.15,44.36 180 top
C3  43.85,20.97 270 top
C4  41.9,34.59 0 top
C5  42.19,39.57 0 top
C6  30.53,27.82 180 top
C7  32.45,48.96 0 bottom
C8  31.08,23.26 270 top
C9  29.89,40.82 90 bottom
C10  40.8,3.8 180 bottom
C12  19.56,34.59 0 top
C13  20.11,42.22 0 top
C14  17.72,26.9 0 top
D1  58.21,41.78 0 top
D2  60.34,33.68 180 top
D3  49.62,19.05 90 top
D4  60.61,24.66 180 top
DS  36.97,41.73 270 bottom
FB1  29.14,24.15 180 top
J1  39.83,8.83 0 top
J2  50.92,44.18 180 top
J3  6.19,26.42 90 bottom
J4  68.55,27.05 90 bottom
J5  6.19,26.42 90 top
J6  68.55,27.05 90 top
J7  56.11,18.77 180 top
J8  23.38,13.5 180 top
MPU  21.83,38.46 180 top
R1  22.73,34.04 90 top
R2  24.96,34.03 90 top
R3  38.83,34.11 90 top
R4  36.7,34.1 90 top
R5  27.28,30.45 270 top
R6  29.81,34.77 90 top
R7  34.16,34.16 270 bottom
R8  32,34.13 270 bottom
R9  36.37,42.71 270 top
R10  30.63,29.93 0 top
R11  36.38,9.18 90 bottom
R12  38.24,18.06 90 top
R13  36.16,18.09 90 top
R14  57.31,33.72 0 top
R15  58.18,43.77 0 top
R16  17.57,29.21 180 top
R19  49.65,22.41 270 top
R20  57.1,24.65 0 top
R21  43.97,27.21 90 bottom
R22  44.94,23.89 180 top
R23  48.14,25.07 180 top
STM32  37.55,25.1 0 top
SW1  22.99,23.78 90 top

### Tracks (layer width: path | path; a pad name or v marks a point on that pad's centre or on a via)
1WIRE  (via drill 0.35)
  Top 0.147: STM32.2 38.53,27.1 v39.09,26.54
  Top 0.152: J6.7 v67.89,26.42 | v67.89,26.42
  Bottom 0.147: v39.09,26.54 39.32,26.31 43.95,26.31 | 45.42,26.31 65,26.31 65.11,26.42 J4.7
  Bottom 0.152: 45.42,26.31 43.95,26.31 43.97,26.33 R21.1 | v67.89,26.42 | v67.89,26.42 J4.7
3V  (via drill 0.35)
  Top 0.4: 67.15,31.5 J6.15 67.47,31.5 v67.79,31.82
  Bottom 0.4: C9.1 30,39.99 32.99,39.99 | 32.99,39.99 35.1,37.87 35.1,37.04 DS.14 | 32.99,39.99 42.76,39.99 51.16,31.59 67.24,31.59 67.15,31.5 J4.15 66.84,31.82 v67.79,31.82
+3V3  (via drill 0.35)
  Top 0.4: J5.4 7.94,15.71 v7.04,15.71 7.07,15.68 v9.84,15.68
  Bottom 0.4: J3.4 9.79,15.62 9.84,15.67 v9.84,15.68
+3V3_APU  (via drill 0.35)
  Top 0.4: STM32.17 42.07,21.97 C3.1 | 22.35,40.69 22.35,41.34 C1.2 23.24,44.32 C2.2 | BMP.6 39.45,38.64 39.45,38.65 40.37,39.57 C5.1 | BMP.8 40.75,39.08 C5.1 | STM32.1 33.29,27.84 31.55,27.84 C6.1 | v26.45,28.89 27.16,29.6 R5.2 27.42,29.46 v27.42,28.89 | C3.1 44.17,22.29 44.91,22.29 44.94,22.32 v44.94,22.35 | C4.1 41.06,34.48 | BMP.2 40.12,36.28 40.12,35.42 C4.1 | C4.1 40.95,34.08 v40.33,33.46 | C5.1 40.69,40.12 v40.69,41.05 | C2.2 21.91,44.36 v21.85,44.3 | v30.6,36.4 30.58,36.4 R6.2 29.76,35.62 v29.01,36.37 | C6.1 30.96,27.25 v30.96,26.65 | v54.03,40.12 53.9,40.12 J2.1 v54.17,38.96 v54.18,38.96 | v56.48,44.27 56.64,44.27 57.15,43.77 R15.1 57.1,43.77 56.58,43.25 56.52,43.25 v56.52,43.31 | MPU.13 v19.24,40.33 | J8.1 27.88,13.93 v27.85,13.95 | J6.3 J6.1 65.28,22.61 v65.25,22.63 67.23,22.63 v67.9,21.96 | J6.3 J6.5 66.65,25.09 v65.45,25.09 68.15,25.09 v68.22,25.16 | MPU.9 22.35,40.69 | MPU.8 22.58,40.46 22.35,40.69 | C2.2 23.2,44.88 v22.36,45.72 | v39.39,5.04 39.75,5.4 J1.4 39.75,5.54 v40.26,5.03 | C5.1 41.61,39.94 v41.61,41 | C4.1 40.95,33.93 v41.37,33.51 v41.38,33.51 | C3.1 44.41,21.97 v44.9,21.48 | v27.74,23.69 27.98,23.69 FB1.2 28.33,24.15 27.88,24.6 v27.72,24.6 | C6.1 31.88,27.47 v31.88,26.59 | J6.3 67.47,23.88 v67.76,24.17
  Bottom 0.4: DS.2 33.8,48.56 C7.1 | 67.62,25.17 67.59,25.14 | 67.36,22.63 67.33,22.61 J4.1 67.26,22.61 v67.9,21.96 | J4.3 66.5,23.89 v65.28,23.89 67.48,23.89 v67.76,24.17 | v65.45,25.09 65.51,25.15 J4.5 68.21,25.15 v68.22,25.16 | C10.1 39.76,3.8 | C10.1 39.85,3.65 | C10.1 39.39,4.26 v39.39,5.04 | C10.1 40.26,4.21 v40.26,5.03
  pour Bottom (no thermals): 13.58,42.78 13.97,42.78 13.97,11.26 13.81,11.1 -1.69,11.1 -1.69,-3.41 -1.58,-3.52 77.47,-3.52 77.47,55.66 77.35,55.77 -1.11,55.77 0.44,42.7 0.44,42.7
BAT_MOTOR_9V  (via drill 0.35)
  Top 0.4: J5.6 7.97,16.82 v6.96,16.82 9.76,16.82 9.8,16.86 v9.82,16.86
  Bottom 0.4: J3.6 7.03,16.89 v6.96,16.82 7,16.86 v9.82,16.86
CURRENT_SENS_M1  (via drill 0.35)
  Top 0.2: J5.8 8.02,18.14 v6.93,18.14 6.97,18.11 v9.85,18.11
  Bottom 0.2: J3.8 9.79,18.16 9.84,18.11 v9.85,18.11
CURRENT_SENS_M2  (via drill 0.35)
  Top 0.2: J5.10 6.97,19.43 v6.93,19.46 9.72,19.46 9.86,19.32 v9.89,19.32
  Bottom 0.2: J3.10 6.97,19.43 v6.93,19.46 7.08,19.32 v9.89,19.32
EN/DIA_M1  (via drill 0.35)
  Top 0.2: J5.18 7.14,24.51 v7.09,24.57 9.78,24.57 9.84,24.5 v9.87,24.5
  Bottom 0.2: J3.18 8.17,24.57 v7.09,24.57 7.15,24.5 v9.87,24.5
EN/DIA_M2  (via drill 0.35)
  Top 0.2: J5.14 7.94,21.87 v6.91,21.87 6.96,21.93 v9.86,21.93
  Bottom 0.2: J3.14 8.13,21.87 v6.91,21.87 6.96,21.93 v9.86,21.93
EN/DIB_M1  (via drill 0.35)
  Top 0.2: J5.16 7.93,23.14 v6.93,23.14 9.73,23.14 v9.85,23.26
  Bottom 0.2: J3.16 9.84,23.24 v9.85,23.25 v9.85,23.26
EN/DIB_M2  (via drill 0.35)
  Top 0.2: J5.12 7.03,20.7 v7.01,20.68 v9.91,20.68
  Bottom 0.2: J3.12 9.83,20.7 9.85,20.68 v9.91,20.68
GND  (via drill 0.35)
  Top 0.2: J5.39 4.38,38.46 v5.74,38.46 3.07,38.46 v3.01,38.4 | J5.37 v5.62,37.21 v5.63,37.2 3.01,37.2 v2.98,37.23 | J5.35 4.38,35.91 v5.75,35.91 5.69,35.85 v2.83,35.85 | J5.33 5.5,34.67 v5.51,34.66 3.02,34.66 v2.97,34.61 | J5.31 v5.69,33.39 5.6,33.3 v2.91,33.3 | J5.29 5.59,32.13 v5.61,32.15 2.87,32.15 v2.85,32.12 | J5.27 4.45,30.76 v5.73,30.76 v5.72,30.76 v2.8,30.76 | J5.25 5.71,29.59 5.72,29.59 v5.68,29.55 2.9,29.55 2.85,29.6 v2.83,29.6 | J5.23 4.38,28.29 v5.72,28.29 5.62,28.2 v2.74,28.2 | J5.21 5.58,27.05 v5.69,26.95 2.82,26.95 2.74,27.03 2.74,27.04 v2.75,27.05 | J5.19 5.69,25.78 v5.74,25.83 5.63,25.72 v2.66,25.72 | J5.17 5.67,24.51 v5.72,24.46 2.76,24.46 v2.73,24.49 | J5.15 5.76,23.24 v5.79,23.27 5.72,23.2 v2.6,23.2 | J5.13 v5.61,21.97 v5.61,21.98 2.74,21.98 v2.71,21.94 | J5.11 4.42,20.63 v5.69,20.63 5.68,20.64 v2.68,20.64 | J5.9 5.54,19.43 v5.58,19.39 v5.57,19.38 2.69,19.38 v2.66,19.41 | J5.7 5.58,18.16 v5.64,18.22 2.68,18.22 v2.6,18.14 | J5.5 4.39,16.93 v5.53,16.93 v5.53,16.92 v2.58,16.92 v2.57,16.91 | J5.3 4.37,15.63 v5.48,15.63 5.47,15.62 v2.53,15.62 | J5.1 4.37,14.37 v5.41,14.37 2.57,14.37 2.56,14.37 2.62,14.43 v2.71,14.43
  Top 0.4: J5.2 7.97,14.29 7.01,14.29 v7.01,14.31 9.85,14.31 9.87,14.34 v9.85,14.35
  Bottom 0.2: J3.37 4.17,37.2 v5.63,37.2 3.01,37.2 v2.98,37.23 | J3.35 5.7,35.94 5.74,35.9 v5.75,35.91 2.9,35.91 v2.83,35.85 | J3.33 v5.51,34.66 5.46,34.61 v2.97,34.61 | J3.29 5.59,32.13 v5.61,32.15 5.59,32.12 v2.85,32.12 | J3.27 5.66,30.86 5.74,30.78 v5.73,30.76 v2.81,30.76 v2.8,30.76 | J3.25 4.2,29.55 v5.68,29.55 2.88,29.55 v2.83,29.6 | J3.23 5.74,28.32 v5.72,28.29 2.84,28.29 v2.75,28.19 v2.74,28.2 | J3.21 4.26,26.95 v5.69,26.95 5.59,27.05 v2.75,27.05 | J3.19 5.69,25.78 v5.74,25.83 5.63,25.72 v2.66,25.72 | J3.17 4.21,24.46 v5.72,24.46 5.69,24.49 v2.73,24.49 | J3.15 5.76,23.24 v5.79,23.27 5.72,23.19 v2.6,23.19 v2.6,23.2 | J3.13 v5.61,21.97 v5.61,21.98 5.58,21.94 v2.71,21.94 | J3.11 5.67,20.7 5.72,20.66 v5.69,20.63 v2.69,20.63 v2.68,20.64 | J3.9 5.52,19.43 v5.57,19.38 5.54,19.41 v2.66,19.41 | J3.7 5.58,18.16 v5.64,18.22 2.68,18.22 v2.6,18.14 | J3.5 5.5,16.89 v5.53,16.93 5.52,16.91 v2.57,16.91 | J3.1 4.17,14.37 v5.41,14.37 2.77,14.37 v2.71,14.43 | J3.39 4.13,38.46 3.01,38.46 3.01,38.45 v3.01,38.4 | J3.31 4.05,33.29 2.91,33.29 v2.91,33.3 | v2.74,28.2 | J3.3 v2.53,15.62
  Bottom 0.4: J3.2 8.19,14.31 v7.01,14.31 9.81,14.31 v9.85,14.35
  pour Route15 (no thermals): 12.31,40.94 12.32,40.95 12.32,12.43 -0.71,12.43 -0.73,12.41 -0.73,40.96
  pour Route2 (no thermals): 12.44,40.99 12.45,41 12.45,12.48 -0.58,12.48 -0.6,12.46 -0.6,41.01
  pour Top (no thermals): 12.54,40.79 12.55,40.8 12.55,12.29 -0.48,12.29 -0.5,12.26 -0.5,40.81
  pour Bottom (no thermals): 12.59,40.79 12.6,40.8 12.6,12.28 -0.43,12.28 -0.45,12.26 -0.45,40.81
GND_APU  (via drill 0.35)
  Top 0.2: MPU.1 24.85,37.2 v24.84,37.18 | MPU.18 19.16,37.21 v19.14,37.19 | MPU.11 21.08,39.74 21.1,39.73 v21.1,39.46 v21.09,39.46 | v22.03,19.76 22.99,20.72 SW1.1 v21.68,22.68 v21.67,22.68 | J7.4 55.11,20.82 v55.11,21.96 v55.12,21.96 | v47.36,40.32 47.74,40.32 J2.5 47.7,39 v47.39,39 | v18.31,42.23 18.33,42.22 C13.1 19.16,42.94 18.9,43.21 v18.9,43.22 | STM32.16 40.35,19.95 v40.42,19.88 | v28.9,30.57 29.54,29.93 R10.1 29.38,29.53 v28.86,29.53 v28.85,29.52 | J8.8 v20.88,13.96 | J8.4 24.88,11.41 v24.89,11.39 | J8.6 v22.88,11.3 v22.87,11.29 | J8.2 26.88,11.36 v26.92,11.31 | D1.1 57.24,41.56 | D2.1 61.38,33.96 | v50.1,16.92 50.1,17.51 D3.1 49.19,17.57 v49.19,16.93 | D1.1 56.78,41.1 v56.75,41.1 | D1.1 57.09,41.78 v56.7,42.17 | v33.92,29.8 34.25,29.8 STM32.32 34.26,28.81 v33.89,28.81 | D2.1 61.7,34.29 v61.87,34.29 | D2.1 61.71,33.06 v61.87,33.06
  Top 0.4: v28.66,28.34 29.19,27.82 C6.2 28.97,27.26 28.66,27.26 v28.64,27.23 | v30.36,21.32 30.36,21.54 C8.2 31.08,21.89 v31.69,21.28 | v43.13,19.13 43.19,19.06 43.86,19.73 C3.2 44.56,19.27 v44.56,19.12 | v18.17,33.58 v18.17,33.57 18.61,34.01 C12.1 18.61,35.12 18.1,35.63 v18.1,35.79 | v25.89,44.98 25.72,44.98 C2.1 25.75,43.71 v25.75,43.7 | v26.06,42.79 26.06,42.77 25.68,42.77 C1.1 25.23,42.23 25.9,41.56 25.96,41.56 v26.06,41.46 | v44.12,40.53 44.12,40.45 43.24,39.57 C5.2 43.04,39.47 v43.04,38.27 | v43.48,35.38 42.85,34.75 C4.2 43.46,33.99 v43.74,33.99 | J1.10 32.82,12.14 v31.99,12.14 | J1.9 v32,4 v31.99,4.01 | J1.12 46.94,4.18 v47.73,4.18 | J1.11 47.39,11.58 v47.39,10.87 | J7.5 v54.11,21.91 | v57.11,21.94 J7.2 57.11,19.55 57.12,19.54 v57.11,19.54 | J6.16 70.41,31.48 v71.78,31.48 69.65,31.48 v69.31,31.81 v69.31,31.82 | J6.14 v71.68,30.23 v71.69,30.22 70.15,30.22 v69.78,29.85 | J6.12 70.46,28.89 v71.69,28.89 69.25,28.89 v69.24,28.91 | J6.10 71.56,27.69 v71.57,27.69 71.55,27.68 v69.24,27.68 | J6.8 71.69,26.42 v71.73,26.45 69.19,26.45 v69.17,26.44 | J6.6 71.71,25.15 71.73,25.12 v71.74,25.13 71.73,25.14 v69.33,25.14 | J1.2 42.01,6.14 v42.01,5.5 | J1.6 v37.55,5.49 v37.56,5.49 | v38.69,38.59 38.8,38.48 BMP.5 | BMP.1 40.75,37.03 v40.71,37.07 40.35,37.07 40.1,37.32 BMP.7 | J7.5 55.1,20.8 55.11,20.82 | J7.5 54.11,19.56 v54.1,19.55 | J7.4 55.11,19.61 v55.1,19.6 | v62.47,23.84 v62.47,23.85 D4.1 62.41,25.4 v62.45,25.4 | v69.32,21.97 69.96,22.61 v71.66,22.61 71.64,22.59 71.62,22.59 71.6,22.61 J6.2 J6.4 70.43,23.91 v71.83,23.91 69.6,23.91 v69.26,24.25 | v19.64,27.78 19.6,27.78 C14.2 18.78,26.85 v19.82,26.85
  Bottom 0.4: v29.2,42.55 29.2,42.46 C9.2 29.94,41.77 v30.67,42.5 | v25.75,43.7 25.73,43.7 | v26.06,41.46 v26.06,41.45 26.05,41.44 | v30.67,47.92 31.5,48.74 C7.2 30.63,49.83 v30.63,49.9 | DS.8 v41.42,47.5 | DS.7 40.15,47.47 v40.07,47.55 | DS.6 38.88,47.5 v38.87,47.51 v38.87,47.52 | DS.5 37.61,47.55 v37.57,47.59 v37.56,47.59 | 71.76,31.5 J4.16 69.63,31.5 v69.31,31.82 | J4.12 71.62,28.96 v71.69,28.89 71.67,28.91 v69.24,28.91 | J4.8 71.69,26.42 71.71,26.44 | J4.2 v71.66,22.61 69.96,22.61 v69.32,21.97 | DS.12 DS.13 v36.34,38.38 | DS.12 DS.11 | DS.11 DS.10 v40.71,37.07 DS.9 41.42,37.94 v41.65,38.17 | DS.12 v37.61,38.36 | v36.34,38.38 | DS.11 38.88,38.4 v38.69,38.59 | v42.73,3.03 42.52,3.03 C10.2 42.44,4.5 v42.83,4.5 | J4.4 69.59,23.88 69.24,24.23 v69.26,24.25 | J4.6 69.17,25.15 69.17,25.14 v69.33,25.14 | v69.17,26.44 71.71,26.44 | 71.71,26.44 v71.73,26.45 | J4.10 69.17,27.69 69.17,27.68 v69.24,27.68 | J4.14 70.2,29.84 v69.79,29.84 v69.78,29.85
  other vias: 9.77,8.64 17.35,17.2 19.27,2.65 26.86,2.98 47.81,29.36 67.84,40.33 20.68,48.92 27.45,48.78 15.6,41.02 19.57,20.77 66.88,17.11 57.32,8.85 46.69,49.1 15.31,45.42 15.95,32.65 61.27,38.44
  pour Route15: 13.68,42.74 14.07,42.74 14.07,11.23 13.9,11.06 -1.59,11.06 -1.59,-3.44 -1.48,-3.56 77.56,-3.56 77.56,55.62 77.45,55.73 -1.01,55.73 -1.06,55.78 0.5,42.67 0.54,42.67
  pour Route2 (no thermals): 13.58,42.77 13.97,42.77 13.97,11.25 13.8,11.08 -1.7,11.08 -1.7,-3.42 -1.58,-3.53 77.46,-3.53 77.46,55.65 77.35,55.76 -1.11,55.76 -1.16,55.8 0.4,42.69 0.44,42.69
  pour Top (no thermals): 13.56,42.79 14.1,42.79 14.1,11.43 13.78,11.11 -1.72,11.11 -1.72,-3.4 -1.61,-3.51 77.44,-3.51 77.44,55.67 77.33,55.78 -1.14,55.78 -1.18,55.82 0.38,42.72 0.42,42.72
GPIO_BUTTOM_1
  Top 0.2: STM32.10 35.55,20.17 31.04,15.67 22.81,15.67 21.88,14.73 J8.7
GPIO_BUTTOM_2
  Top 0.2: STM32.9 30.84,16.98 21.69,16.98 19.88,15.17 J8.9
GPIO_BUTTOM_3
  Top 0.2: STM32.8 33.35,21.56 29.65,17.86 21.29,17.86 18.88,15.45 J8.10
INA_M1  (via drill 0.35)
  Top 0.2: J5.26 v6.99,29.59 9.78,29.59 9.83,29.54 v9.86,29.54
  Bottom 0.2: J3.26 v6.99,29.59 7.04,29.54 v9.86,29.54
INA_M2  (via drill 0.35)
  Top 0.2: J5.22 6.98,27.05 6.96,27.07 v6.91,27.07 9.84,27.07 9.9,27.02 v9.92,27.02
  Bottom 0.2: J3.22 8.2,27.07 v6.91,27.07 6.96,27.02 v9.92,27.02
INB_M1  (via drill 0.35)
  Top 0.2: J5.24 7.95,28.24 v6.91,28.24 6.94,28.27 v9.94,28.27
  Bottom 0.2: J3.24 9.9,28.32 v9.94,28.28 v9.94,28.27
INB_M2  (via drill 0.35)
  Top 0.2: J5.20 7.96,25.7 v6.96,25.7 6.97,25.71 v9.94,25.71
  Bottom 0.2: J3.20 9.91,25.78 9.96,25.73 v9.94,25.71
JACK  (via drill 0.35)
  Top 0.2: J5.28 6.99,30.86 v6.99,30.86 9.81,30.86 v9.85,30.89
  Bottom 0.2: J3.28 8.25,30.89 v9.85,30.89
MISO  (via drill 0.35)
  Top 0.2: STM32.12 37.15,19.87 v37.16,19.86
  Bottom 0.147: v37.16,19.86 37.16,15.37 arc90 37.36,15.17 38.1,15.17 arc-90 38.3,14.97 38.3,14.96 arc-90 38.1,14.76 36.22,14.76 arc90 36.02,14.56 36.02,14.54 arc90 36.22,14.34 38.1,14.34 arc-90 38.3,14.14 38.3,14.13 arc-90 38.1,13.93 36.22,13.93 arc90 36.02,13.73 36.02,13.72 arc90 36.22,13.52 38.1,13.52 arc-90 38.3,13.31 38.3,13.3 arc-90 38.1,13.1 37.36,13.1 arc90 37.16,12.9 37.16,10.81 36.4,10.04
  Bottom 0.2: 36.4,10.04 R11.2
MONITORING_ALIM_APU  (via drill 0.35)
  Top 0.2: STM32.28 38.12,29.46 38.12,30.78 40.11,32.77 47.92,32.77 v47.93,32.79
  Top 0.4: J6.13 67.1,29.83 v67.38,29.83 v67.39,29.83
  Bottom 0.2: v47.93,32.79 50.53,30.18 65.65,30.18 | J4.13 J6.13
  Bottom 0.4: J6.13 66.99,30.23 v67.38,29.83 | J4.13 65.69,30.23 65.65,30.18
MONITORING_ALIM_MOTOR  (via drill 0.35)
  Top 0.2: J5.34 v6.96,34.66 v9.88,34.66 v9.89,34.65
  Bottom 0.2: J3.34 8.22,34.66 v6.96,34.66 v6.97,34.65 v9.89,34.65
MONITORING_ALIM_SEQ  (via drill 0.35)
  Top 0.2: J5.36 7.97,36 v6.86,36 7,35.87 v9.92,35.87
  Bottom 0.2: J3.36 9.87,35.94 9.93,35.88 v9.92,35.87
MOSI
  Top 0.147: STM32.13 37.95,19.21 R12.2
N301
  Top 0.147: R3.2 38.83,35.2 39.45,35.82 BMP.3
N303
  Top 0.147: BMP.4 38.06,36.31 R4.2
N$1
  Top 0.147: MPU.24 24.69,34.88 R2.2
N$2
  Top 0.147: MPU.23 22.58,35.04 R1.2
N$3
  Top 0.2: MPU.10 21.58,41.13 21.59,41.13 21.59,41.7 C13.2
N$4
  Bottom 0.147: DS.15 33.8,35.37 R7.1
N$5
  Bottom 0.147: DS.16 32.53,35.51 R8.1
N$6  (via drill 0.35)
  Top 0.2: v36.34,44.75 36.34,43.59 R9.1
  Bottom 0.2: DS.4 v36.34,44.75
N$7  (via drill 0.35)
  Top 0.2: v36.39,7.1 36.39,6.26 J1.7
  Bottom 0.2: R11.1 v36.38,7.1 v36.39,7.1
N$8
  Top 0.2: C8.1 32.03,24.26 32.46,24.7 STM32.5
  Top 0.4: FB1.1 30.97,24.15 C8.1
N$9
  Top 0.147: R13.1 37.96,15.43 43.78,15.43 44.22,14.99 44.22,11.11 43.46,10.35 41.03,10.35 38.59,7.92 38.59,6.26 J1.5
N$10
  Top 0.147: R12.1 39.01,16.44 40.11,16.44 arc90 40.31,16.64 40.31,17.11 arc-90 40.51,17.31 41.82,17.31 arc-90 42.02,17.11 42.02,16.64 arc90 42.22,16.44 44.13,16.44 45.35,15.22 45.35,10.71 43.97,9.32 41.68,9.32 40.85,8.49 J1.3
N$11
  Top 0.2: MPU.20 21.08,35.16 C12.2
N$12
  Top 0.2: R10.2 32.22,30.66 35.19,30.66 35.55,30.3 STM32.31
N$13
  Top 0.2: D1.2 59.03,41.85 R15.2
N$14
  Top 0.2: R19.2 49.65,20.13 D3.2
N$15
  Top 0.4: R20.2 59.56,24.65 D4.2
N$16
  Top 0.2: R22.2 STM32.19
N$17
  Top 0.2: R23.2 43.36,25.07 42.99,24.7 STM32.20
N$40
  Top 0.2: R14.2 59.55,33.72 D2.2
N$61
  Top 0.2: R16.1 19.95,29.21 SW1.2
NRST  (via drill 0.35)
  Top 0.2: v36.59,25.43 33.41,25.43 STM32.4 26.59,25.5 25.76,24.67 25.76,19.89 24.77,18.9 18.73,18.9 16.72,20.91 C14.1 | v45.66,34.4 45.66,40.34 47.5,42.18 50.28,42.18 50.92,41.54 J2.3 | R16.2 | R16.2 C14.1 | 16.11,26.29 C14.1
  Bottom 0.2: v45.66,34.4 36.74,25.48 36.59,25.48 v36.59,25.43
PWM_M1  (via drill 0.35)
  Top 0.2: J5.30 6.98,32.13 v6.96,32.15 9.82,32.15 9.84,32.16 v9.85,32.16
  Bottom 0.2: J3.30 8.21,32.15 v6.96,32.15 v9.84,32.15 v9.85,32.16
PWM_M2  (via drill 0.35)
  Top 0.2: J5.32 7.95,33.31 v7.01,33.31 9.84,33.31 v9.9,33.37
  Bottom 0.2: J3.32 9.87,33.4 v9.9,33.37
RST_DS  (via drill 0.35)
  Top 0.2: STM32.3 v35.1,26.3 | v35.1,26.3 | v35.53,34.2 35.53,39.98 36.37,40.81 R9.2
  Bottom 0.2: v35.1,26.3 35.73,26.92 35.73,34 v35.53,34.2
RX_APU  (via drill 0.35)
  Top 0.147: STM32.27 38.75,30.31 40.25,31.81 46.52,31.81 v46.59,31.73
  Top 0.4: v68.07,28.95 J6.11
  Bottom 0.147: v46.59,31.73 49.29,29.04
  Bottom 0.152: 49.29,29.04 49.37,28.96 J4.11
  Bottom 0.4: J4.11 v68.07,28.96 v68.07,28.95
RX_LTS
  Top 0.147: J7.1 58.11,22.4 55.82,24.7 | 55.82,24.7 56.2,24.7 R20.1 | R23.1 49.37,24.7 55.82,24.7
SCL  (via drill 0.35)
  Top 0.147: R1.1 22.99,32.94 v22.99,32.41 | R6.1 29.74,33.85 v29.74,32.95 30.36,32.32 36.23,32.32 36.7,32.8 R4.1 | J8.5
  Top 0.2: R4.1 36.7,32.38 v36.8,32.28 | v37.12,30.4 37.12,29.33 STM32.29 | J8.5 v23.88,14.16
  Bottom 0.147: R8.2 31.93,33.22 31.93,32.77 29.91,32.77 | 29.91,32.77 v29.74,32.95 | 29.91,32.77 29.6,32.77 29.25,32.41 v22.99,32.41 22.99,31.52 23.88,30.63 v23.88,14.16
  Bottom 0.2: v36.8,32.28 36.8,30.72 v37.12,30.4
SCL_SEQ  (via drill 0.35)
  Top 0.2: J5.38 6.87,37.21 v6.85,37.2 9.87,37.2 v9.92,37.14
  Bottom 0.2: J3.38 8.21,37.2 v6.85,37.2 6.91,37.14 v9.92,37.14
SCLK
  Top 0.147: STM32.11 36.35,19.13 R13.2
SDA  (via drill 0.35)
  Top 0.147: R3.1 38.74,33.16 38.74,32.59 37.48,31.33 36.44,31.33 36.41,31.36 36.37,31.36 | 36.37,31.36 34.37,31.36 | 36.37,31.36 36.37,29.32 STM32.30 | 34.37,31.36 34.37,31.67 v34.39,31.69 | v25.84,14.02 25.88,13.98 J8.3 | R2.1 24.81,33.03 v24.81,28.5 | R5.1 27.28,32.31 26.41,33.17 R2.1 | 34.37,31.36 27.22,31.36
  Top 0.152: R2.1 | 27.22,31.36 R5.1
  Bottom 0.147: v34.39,31.69 34.39,33.07 R7.2 | v24.81,28.5 24.81,15.05 v25.84,14.02
SDA_SEQ  (via drill 0.35)
  Top 0.2: J5.40 8.02,38.47 v6.89,38.47 v6.9,38.47 v10.03,38.47
  Bottom 0.2: v6.89,38.47 6.91,38.48 J3.40 10,38.48 v10.02,38.47 v10.03,38.47
SWCLK
  Top 0.147: STM32.24 45.19,27.9
  Top 0.15: 45.19,27.9 48.65,31.36
  Top 0.152: 48.65,31.36 50.92,33.63 J2.4
SWDIO
  Top 0.147: STM32.23 46.83,27.1
  Top 0.152: 46.83,27.1 53.46,33.72 J2.2
  Top 0.2: J2.2 55.61,33.72 R14.1
TX_APU  (via drill 0.35)
  Top 0.147: STM32.26 39.55,30.36 39.54,30.37 39.83,30.66 v45.32,30.66
  Top 0.152: v68.04,27.68 66.72,27.68 J6.9
  Top 0.4: 66.73,27.71 J6.9
  Bottom 0.147: v45.32,30.66 48.19,27.78 64.98,27.78 65.3,27.78 66.35,27.78 66.45,27.69 J4.9
  Bottom 0.152: J4.9 v68.03,27.69 v68.04,27.68
  Bottom 0.4: 65.38,27.71 65.3,27.78
TX_LTS
  Top 0.147: 49.01,23.9 R19.1 | 48.43,23.9 49.01,23.9 | 49.01,23.9 54.43,23.9 56.11,22.22 J7.3 | R22.1 48.23,23.9
  Top 0.152: 48.23,23.9 48.43,23.9